# Altium project MotherBoard.PrjPcb (part 2 of 3)

## Sheet WIFI_BT.SchDoc
size A3; SheetNumber: 12; SheetTotal: 16
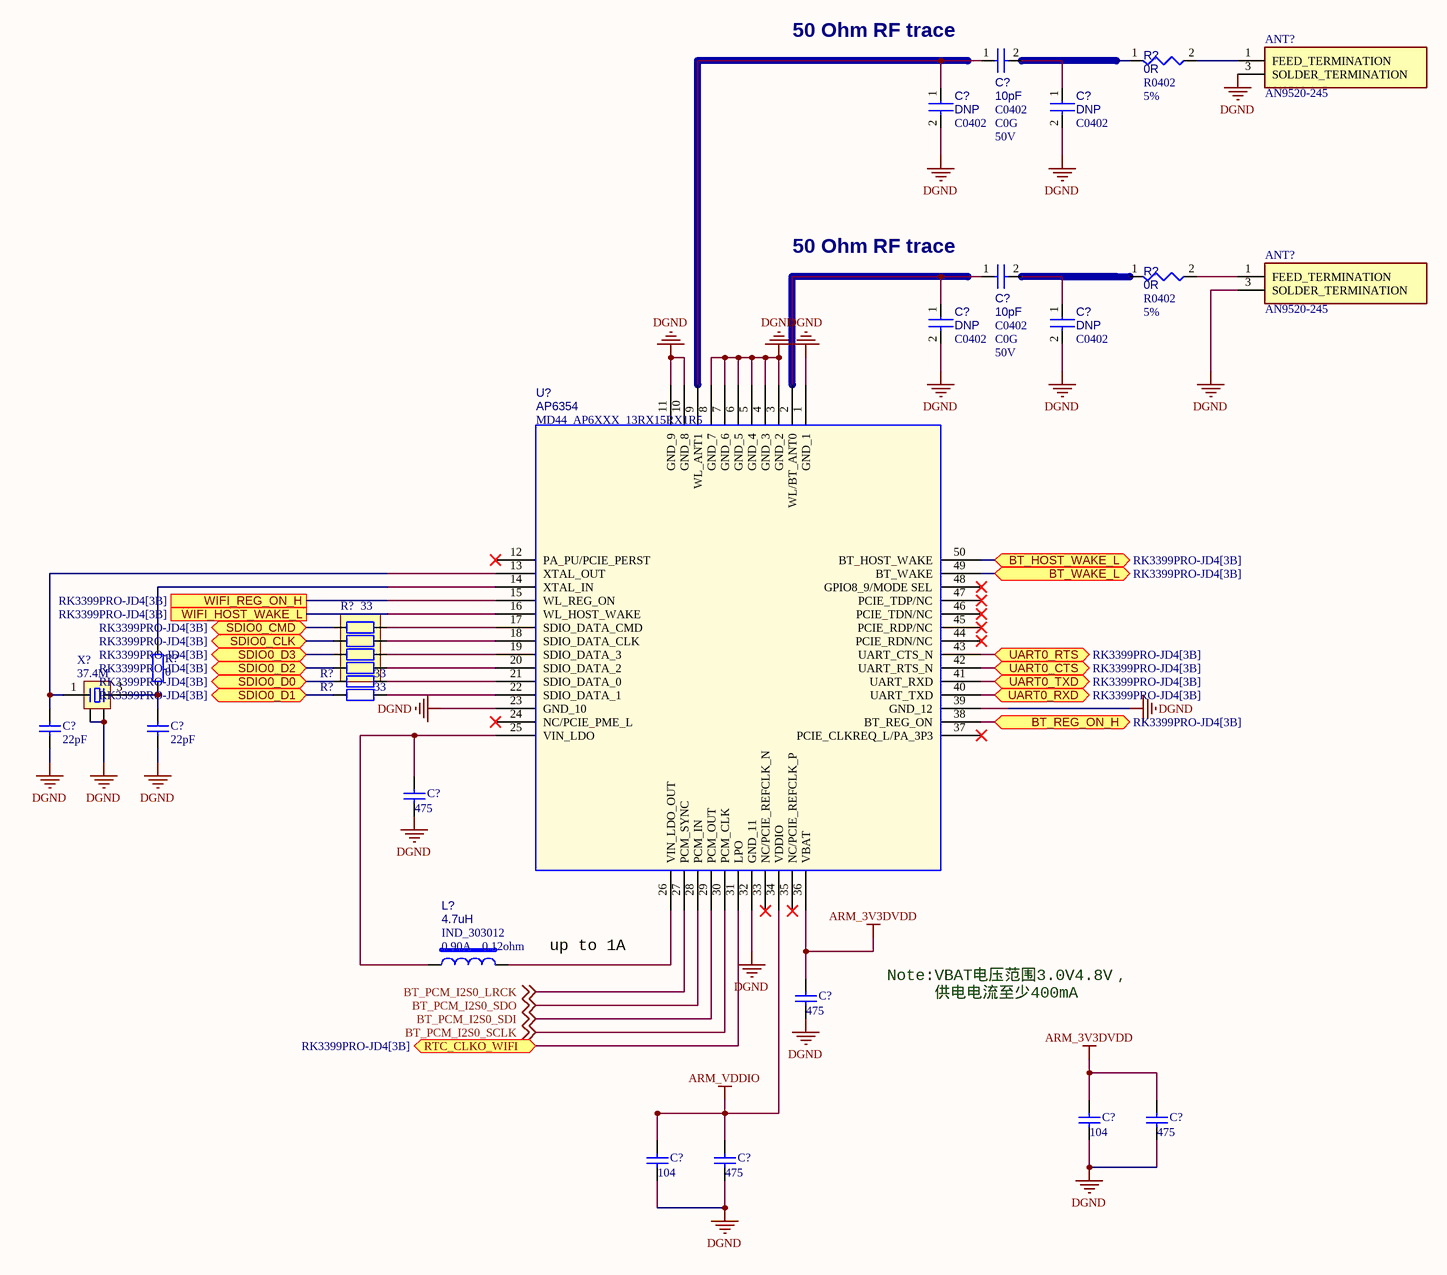
[diagram p7: WIFI_BT.SchDoc]

### Parts
(Parts that share a designator on the sheet are numbered #1, #2 ... from top to bottom, then left to right.)
ANT?#1  AN9520-245  [AN9520245]
ANT?#2  AN9520-245  [AN9520245]
C?#25  value 10pF  Voltage: 50V  Dielectric: C0G  [C0402]  (hidden comment: CAP NP_Dup3)
C?#26  value DNP  [C0402]  (hidden comment: CAP NP_Dup3)
C?#27  value DNP  [C0402]  (hidden comment: CAP NP_Dup3)
C?#28  value 10pF  Voltage: 50V  Dielectric: C0G  [C0402]  (hidden comment: CAP NP_Dup3)
C?#29  value DNP  [C0402]  (hidden comment: CAP NP_Dup3)
C?#30  value DNP  [C0402]  (hidden comment: CAP NP_Dup3)
C?#31  22pF  [C 0603_L]
C?#32  22pF  [C 0603_L]
C?#33  475  [C 0603_L]
C?#34  475  [C 0603_L]
C?#35  104  [C 0603_L]
C?#36  475  [C 0603_L]
C?#37  104  [C 0603_L]
C?#38  475  [C 0603_L]
L?#1  value 4.7uH  DC Resistor: 0.12ohm  Isat: 0.90A  PCB Footprint: IND_303012  [CD73]  (hidden comment: INDUCTORS OF FERRITE)
R?#46  value 0R  Tolerance: 5%  [R0402]  (hidden comment: RESISTOR_Dup2)
R?#47  value 0R  Tolerance: 5%  [R0402]  (hidden comment: RESISTOR_Dup2)
R?#48  33  [RCA-8P4R-0603]
R?#49  33  [R 0603_L]
R?#50  0  [R 0603_L]
R?#51  33  [R 0603_L]
U?#14  value AP6354  [MD44_AP6XXX_13RX15RX1R5]  (hidden comment: MODULE_AP6354)
X?#1  37.4M  [OSC 3225-4P]

### Ports
BT_HOST_WAKE_L (bidir, see RK3399PRO-JD4[3B]), BT_REG_ON_H (bidir, see RK3399PRO-JD4[3B]), BT_WAKE_L (bidir, see RK3399PRO-JD4[3B]), RTC_CLKO_WIFI (bidir, see RK3399PRO-JD4[3B]), SDIO0_CLK (bidir, see RK3399PRO-JD4[3B]), SDIO0_CMD (bidir, see RK3399PRO-JD4[3B]), SDIO0_D0 (bidir, see RK3399PRO-JD4[3B]), SDIO0_D1 (bidir, see RK3399PRO-JD4[3B]), SDIO0_D2 (bidir, see RK3399PRO-JD4[3B]), SDIO0_D3 (bidir, see RK3399PRO-JD4[3B]), UART0_CTS (bidir, see RK3399PRO-JD4[3B]), UART0_RTS (bidir, see RK3399PRO-JD4[3B]), UART0_RXD (bidir, see RK3399PRO-JD4[3B]), UART0_TXD (bidir, see RK3399PRO-JD4[3B]), WIFI_HOST_WAKE_L (see RK3399PRO-JD4[3B]), WIFI_REG_ON_H (see RK3399PRO-JD4[3B])

### Nets
ARM_3V3DVDD: C?#34.1 C?#35.1 C?#36.1 U?#14.36(VBAT)
ARM_VDDIO: C?#37.1 C?#38.1 U?#14.34(VDDIO)
DGND: ANT?#1.3(SOLDER_TERMINATION) ANT?#2.3(SOLDER_TERMINATION) C?#26.2 C?#27.2 C?#29.2 C?#30.2 C?#31.2 C?#32.2 C?#33.2 C?#34.2 C?#35.2 C?#36.2 C?#37.2 C?#38.2 U?#14.1(GND_1) U?#14.3(GND_2) U?#14.4(GND_3) U?#14.5(GND_4) U?#14.6(GND_5) U?#14.7(GND_6) U?#14.8(GND_7) U?#14.10(GND_8) U?#14.11(GND_9) U?#14.23(GND_10) U?#14.32(GND_11) U?#14.39(GND_12) X?#1.2 X?#1.4
BT_PCM_I2S0_LRCK: U?#14.27(PCM_SYNC) ; off-sheet BT_PCM_I2S0_LRCK
BT_PCM_I2S0_SCLK: U?#14.30(PCM_CLK) ; off-sheet BT_PCM_I2S0_SCLK
BT_PCM_I2S0_SDI: U?#14.29(PCM_OUT) ; off-sheet BT_PCM_I2S0_SDI
BT_PCM_I2S0_SDO: U?#14.28(PCM_IN) ; off-sheet BT_PCM_I2S0_SDO
GPIO0_B2_D_1.8V: U?#14.15(WL_REG_ON) ; port WIFI_REG_ON_H
PMUIO2_VOLSEL: U?#14.38(BT_REG_ON) ; port BT_REG_ON_H
RTC_CLKO_WIFI: U?#14.31(LPO) ; port RTC_CLKO_WIFI
SDIO0_CLKOUT: R?#48.2 ; port SDIO0_CLK
SDIO0_CMD: R?#48.1 ; port SDIO0_CMD
SDIO0_D0: R?#49.1 ; port SDIO0_D0
SDIO0_D1: R?#51.1 ; port SDIO0_D1
SDIO0_D2: R?#48.4 ; port SDIO0_D2
SDIO0_D3: R?#48.3 ; port SDIO0_D3
SDIO0_DETN: U?#14.49(BT_WAKE) ; port BT_WAKE_L
SDIO0_INTN: U?#14.50(BT_HOST_WAKE) ; port BT_HOST_WAKE_L
SDIO0_WRPT: U?#14.16(WL_HOST_WAKE) ; port WIFI_HOST_WAKE_L
UART0_CTSN: U?#14.42(UART_RTS_N) ; port UART0_CTS
UART0_RTSN: U?#14.43(UART_CTS_N) ; port UART0_RTS
UART0_RX: U?#14.40(UART_TXD) ; port UART0_RXD
UART0_TX: U?#14.41(UART_RXD) ; port UART0_TXD
NetANT?#1_1: ANT?#1.1(FEED_TERMINATION) R?#46.2
NetANT?#2_1: ANT?#2.1(FEED_TERMINATION) R?#47.2
NetC?#25_1: C?#25.1 C?#26.1 U?#14.9(WL_ANT1)
NetC?#25_2: C?#25.2 C?#27.1
NetC?#28_1: C?#28.1 C?#29.1 U?#14.2(WL/BT_ANT0)
NetC?#28_2: C?#28.2 C?#30.1
NetC?#31_1: C?#31.1 U?#14.13(XTAL_OUT) X?#1.1
NetC?#32_1: C?#32.1 R?#50.1 X?#1.3
NetC?#33_1: C?#33.1 L?#1.1 U?#14.25(VIN_LDO)
NetL?#1_2: L?#1.2 U?#14.26(VIN_LDO_OUT)
NetR?#48_5: R?#48.5 U?#14.20(SDIO_DATA_2)
NetR?#48_6: R?#48.6 U?#14.19(SDIO_DATA_3)
NetR?#48_7: R?#48.7 U?#14.18(SDIO_DATA_CLK)
NetR?#48_8: R?#48.8 U?#14.17(SDIO_DATA_CMD)
NetR?#49_2: R?#49.2 U?#14.21(SDIO_DATA_0)
NetR?#50_2: R?#50.2 U?#14.14(XTAL_IN)
NetR?#51_2: R?#51.2 U?#14.22(SDIO_DATA_1)

Not connected (* = marked no-connect by the designer): R?#46 1; R?#47 1; U?#14 12(PA_PU/PCIE_PERST)* 24(NC/PCIE_PME_L)* 33(NC/PCIE_REFCLK_N)* 35(NC/PCIE_REFCLK_P)* 37(PCIE_CLKREQ_L/PA_3P3)* 44(PCIE_RDN/NC)* 45(PCIE_RDP/NC)* 46(PCIE_TDN/NC)* 47(PCIE_TDP/NC)* 48(GPIO8_9/MODE_SEL)*

### Notes on the sheet
- (near C?#25) 50 Ohm RF trace
- (near C?#28) 50 Ohm RF trace
- up to 1A
- Note:VBAT电压范围3.0V4.8V，
  供电电流至少400mA

### Library data of the parts
ANT?#1 ANT?#2 = AN9520-245: Antenna; Manufacturer_Name: Rainsun microwave Tech; Datasheet Link: https://datasheet.lcsc.com/szlcsc/1810251713_Rainsun-microwave-Tech-AN9520-245_C99665.pdf; Height: 1.2mm; Manufacturer_Part_Number: AN9520-245
C?#25 = CAP NP_Dup3: cap,10.00pF,+/-0.5,50V,C0G,C0402; Part Reference: C6101; Manufacturer PN: C1005C0G1H100D050BA; Manufacturer: TDK; Tolerance: +/-0.5pF; Priority: A; PCB Footprint: C0402; Created by: JJJ; Part Type: C0402; RK PN: C1005C0G1H100D050BA
C?#26 = CAP NP_Dup3: Did Not Place.; Part Reference: C6102; Manufacturer PN: DNPC0402; Priority: A; PCB Footprint: C0402; Created by: JJJ; Part Type: DNP; RK PN: DNPC0402
C?#27 = CAP NP_Dup3: Did Not Place.; Part Reference: C6103; Manufacturer PN: DNPC0402; Priority: A; PCB Footprint: C0402; Created by: JJJ; Part Type: DNP; RK PN: DNPC0402
C?#28 = CAP NP_Dup3: cap,10.00pF,+/-0.5,50V,C0G,C0402; Part Reference: C6104; Manufacturer: TDK; RK PN: C1005C0G1H100D050BA; Priority: A; Tolerance: +/-0.5pF; PCB Footprint: C0402; Part Type: C0402; Manufacturer PN: C1005C0G1H100D050BA; Created by: JJJ
C?#29 = CAP NP_Dup3: Did Not Place.; Part Reference: C6105; RK PN: DNPC0402; Priority: A; PCB Footprint: C0402; Part Type: DNP; Manufacturer PN: DNPC0402; Created by: JJJ
C?#30 = CAP NP_Dup3: Did Not Place.; Part Reference: C6106; RK PN: DNPC0402; Priority: A; PCB Footprint: C0402; Part Type: DNP; Manufacturer PN: DNPC0402; Created by: JJJ
C?#31-C?#38 = Cap: Capacitor; Published: 8-Jun-2000; LatestRevisionDate: 17-Jul-2002; LatestRevisionNote: Re-released for DXP Platform.; PackageReference: RAD-0.3; Publisher: Altium Limited
  C?#31 C?#32: Value: 22pF
  C?#33 C?#34 C?#36 C?#38: Value: 475
  C?#35 C?#37: Value: 104
L?#1 = INDUCTORS OF FERRITE: Power Inductor,4.7uH,0.2,IND_303012; Part Reference: L6101; Manufacturer PN: SWPA3012S4R7MT; Manufacturer: sunlord; Resonace frequency: 61M; Irms: 1.24A; Tolerance: 20%; Priority: A; Created by: YTL; Part Type: POWER_IND; RK PN: SWPA3012S4R7MT
R?#46 = RESISTOR_Dup2: 通用厚膜电阻,0R,+/-5%,R0402,1/16W.; Part Reference: R6102; Manufacturer: YAGEO; RK PN: RC0402JR-070RL; Priority: A; Wattage: 1/16W; PCB Footprint: R0402; Part Type: 通用厚膜电阻; Manufacturer PN: RC0402JR-070RL; Created by: YTL
R?#47 = RESISTOR_Dup2: 通用厚膜电阻,0R,+/-5%,R0402,1/16W.; Part Reference: R6104; Manufacturer: YAGEO; RK PN: RC0402JR-070RL; Priority: A; Wattage: 1/16W; PCB Footprint: R0402; Part Type: 通用厚膜电阻; Manufacturer PN: RC0402JR-070RL; Created by: YTL
R?#48 = R-8P4R: 贴片排阻; BOM名称: 贴片网络排阻
R?#49 R?#51 = 0805 电阻: 贴片电阻 0805 电阻; ComponentLink1Description: 供应商链接; ComponentLink1URL: http://www.szlcsc.com/product/details_18165.html; Package: 0805; Supplier: LC; SuppliersPartNumber: C17477
R?#50 = R: as R?#23 on sheet DigiConn; BOM名称: 贴片电阻; 联系售后: https://shop463601444.taobao.com
U?#14 = MODULE_AP6354: 2x2 WiFi + Bluetooth4.1; Part Reference: U6101; Manufacturer: Ampak（正基科技）; Priority: A; PCB Footprint: MD44_AP6XXX_13RX15RX1R5; Created by: JJJ; Manufacturer PN: AP6354; Part Type: module; RK PN: AP6354
X?#1 = XTAL-4P: 4脚无源晶振; 版权归属: 封装库来自淘宝卖家 ID：黄晶宝石; BOM名称: 4脚无源晶振; 学习资源: https://shop463601444.taobao.com

## Sheet CODEC.SchDoc
size A3; SheetNumber: 14; SheetTotal: 16
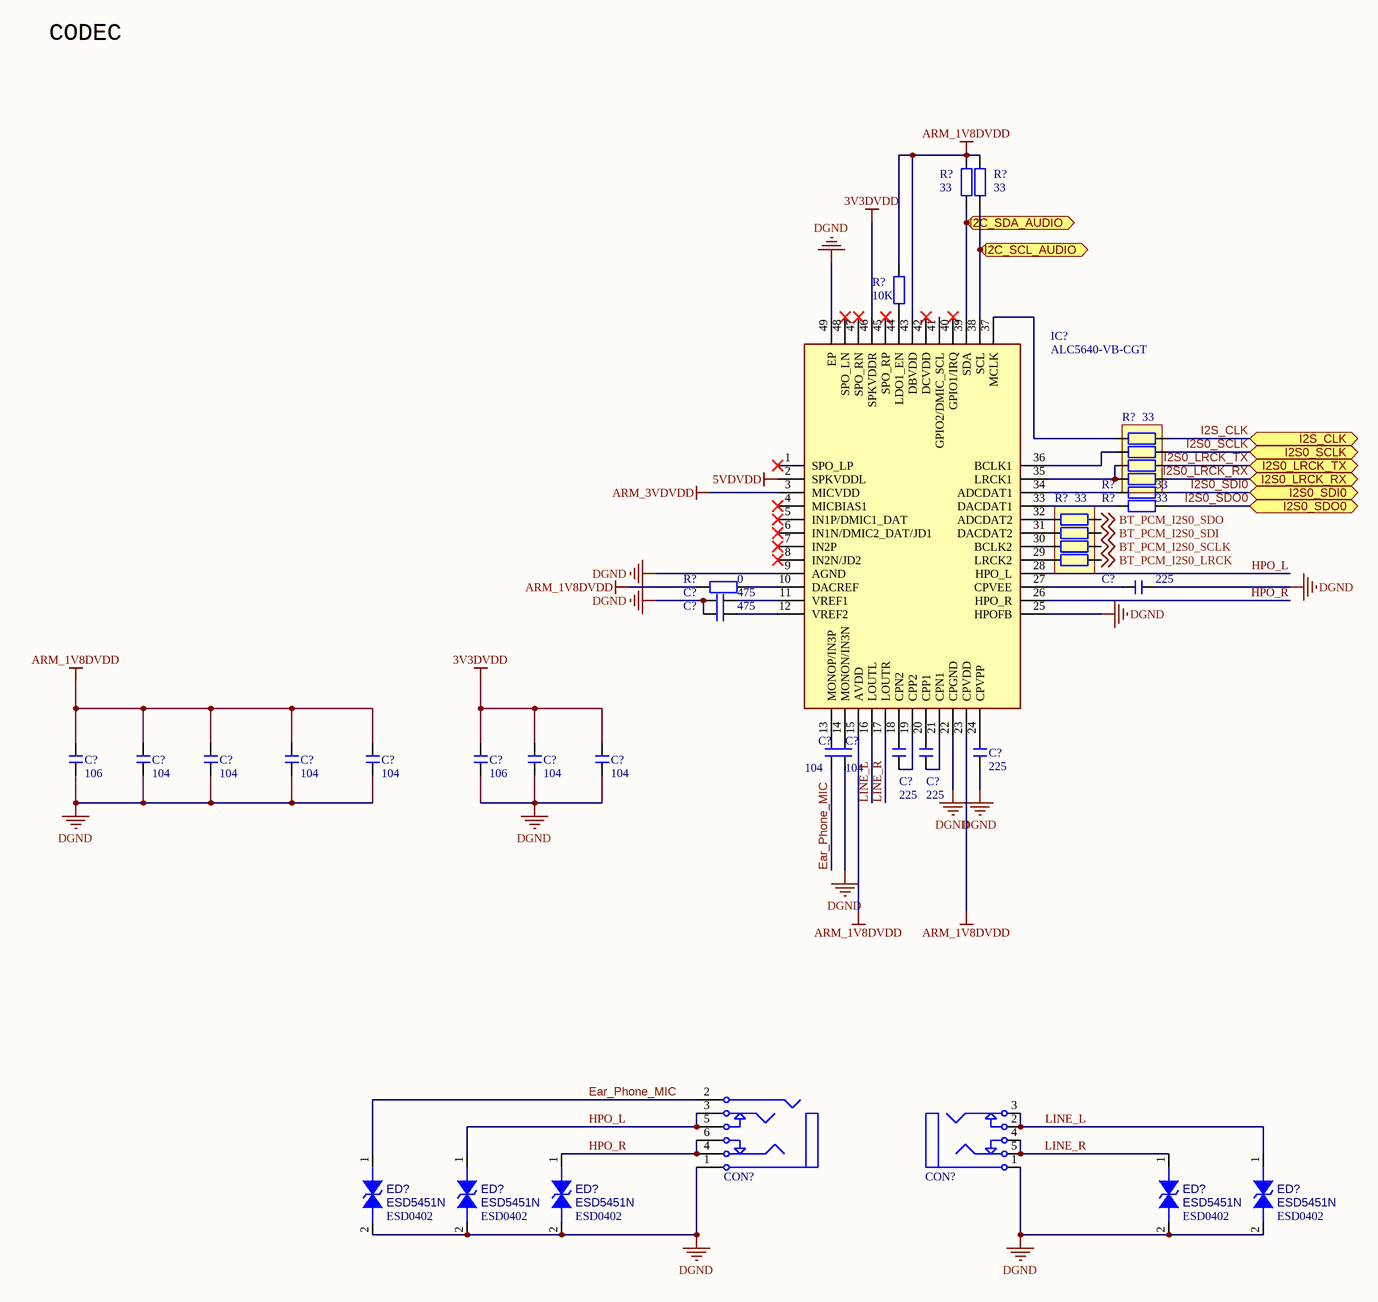
[diagram p8: CODEC.SchDoc]

### Parts
(Parts that share a designator on the sheet are numbered #1, #2 ... from top to bottom, then left to right.)
C?#39  225  [C 0603_L]
C?#40  475  [C 0603_L]
C?#41  475  [C 0603_L]
C?#42  104  [C 0603_L]
C?#43  104  [C 0603_L]
C?#44  225  [C 0603_L]
C?#45  225  [C 0603_L]
C?#46  225  [C 0603_L]
C?#47  106  [C 0603_L]
C?#48  104  [C 0603_L]
C?#49  104  [C 0603_L]
C?#50  104  [C 0603_L]
C?#51  104  [C 0603_L]
C?#52  106  [C 0603_L]
C?#53  104  [C 0603_L]
C?#54  104  [C 0603_L]
CON?#1  PJ325_BK  [PJ325_PK]  (value not drawn)
CON?#2  PJ342  [PJ342B]  (value not drawn)
ED?#1  value ESD5451N  [ESD0402]  (hidden comment: DIODE BI_DIR TRIG)
ED?#2  value ESD5451N  [ESD0402]  (hidden comment: DIODE BI_DIR TRIG)
ED?#3  value ESD5451N  [ESD0402]  (hidden comment: DIODE BI_DIR TRIG)
ED?#4  value ESD5451N  PCB Footprint: ESD0402  [SOD-323]  (hidden comment: DIODE BI_DIR TRIG)
ED?#5  value ESD5451N  PCB Footprint: ESD0402  [SOD-323]  (hidden comment: DIODE BI_DIR TRIG)
IC?#5  ALC5640-VB-CGT  [QFN40P600X600X100-49N]
R?#52  33  [R 0603_L]
R?#53  33  [R 0603_L]
R?#54  10K  [R 0603_L]
R?#55  33  [RCA-8P4R-0603]
R?#56  33  [R 0603_L]
R?#57  33  [R 0603_L]
R?#58  33  [RCA-8P4R-0603]
R?#59  0  [R 0603_L]

### Ports
I2C_SCL_AUDIO (bidir), I2C_SDA_AUDIO (bidir), I2S0_LRCK_RX (bidir), I2S0_LRCK_TX (bidir), I2S0_SCLK (bidir), I2S0_SDI0 (bidir), I2S0_SDO0 (bidir), I2S_CLK (bidir)

### Nets
3V3DVDD: C?#52.2 C?#53.2 C?#54.2 IC?#5.46(SPKVDDR)
5VDVDD: IC?#5.2(SPKVDDL)
ARM_1V8DVDD: C?#47.2 C?#48.2 C?#49.2 C?#50.2 C?#51.2 IC?#5.15(AVDD) IC?#5.23(CPVDD) IC?#5.43(DBVDD) R?#52.2 R?#53.2 R?#54.2 R?#59.1
ARM_3VDVDD: IC?#5.3(MICVDD)
DGND: C?#39.1 C?#40.2 C?#41.2 C?#43.2 C?#46.2 C?#47.1 C?#48.1 C?#49.1 C?#50.1 C?#51.1 C?#52.1 C?#53.1 C?#54.1 CON?#1.1 CON?#2.1 ED?#1.2 ED?#2.2 ED?#3.2 ED?#4.2 ED?#5.2 IC?#5.9(AGND) IC?#5.22(CPGND) IC?#5.25(HPOFB) IC?#5.49(EP)
BT_PCM_I2S0_LRCK: R?#58.5 ; off-sheet BT_PCM_I2S0_LRCK
BT_PCM_I2S0_SCLK: R?#58.6 ; off-sheet BT_PCM_I2S0_SCLK
BT_PCM_I2S0_SDI: R?#58.7 ; off-sheet BT_PCM_I2S0_SDI
BT_PCM_I2S0_SDO: R?#58.8 ; off-sheet BT_PCM_I2S0_SDO
Ear_Phone_MIC: C?#42.2 CON?#2.2 ED?#1.1
HPO_L: CON?#2.3 CON?#2.5 ED?#2.1 IC?#5.28(HPO_L)
HPO_R: CON?#2.4 CON?#2.6 ED?#3.1 IC?#5.26(HPO_R)
I2C1_SCL: IC?#5.38(SCL) R?#53.1 ; port I2C_SCL_AUDIO
I2C1_SDA: IC?#5.39(SDA) R?#52.1 ; port I2C_SDA_AUDIO
I2S0_LRCK_RX: R?#55.5 ; port I2S0_LRCK_RX
I2S0_LRCK_TX: R?#55.6 ; port I2S0_LRCK_TX
I2S0_SCLK: R?#55.7 ; port I2S0_SCLK
I2S0_SDI0: R?#56.2 ; port I2S0_SDI0
I2S0_SDO0: R?#57.2 ; port I2S0_SDO0
I2S_CLK: R?#55.8 ; port I2S_CLK
LINE_L: CON?#1.2 CON?#1.3 ED?#5.1 IC?#5.16(LOUTL)
LINE_R: CON?#1.4 CON?#1.5 ED?#4.1 IC?#5.17(LOUTR)
NetC?#39_2: C?#39.2 IC?#5.27(CPVEE)
NetC?#40_1: C?#40.1 IC?#5.11(VREF1)
NetC?#41_1: C?#41.1 IC?#5.12(VREF2)
NetC?#42_1: C?#42.1 IC?#5.13(MONOP/IN3P)
NetC?#43_1: C?#43.1 IC?#5.14(MONON/IN3N)
NetC?#44_1: C?#44.1 IC?#5.18(CPN2)
NetC?#44_2: C?#44.2 IC?#5.19(CPP2)
NetC?#45_1: C?#45.1 IC?#5.20(CPP1)
NetC?#45_2: C?#45.2 IC?#5.21(CPN1)
NetC?#46_1: C?#46.1 IC?#5.24(CPVPP)
NetIC?#5_10: IC?#5.10(DACREF) R?#59.2
NetIC?#5_29: IC?#5.29(LRCK2) R?#58.4
NetIC?#5_30: IC?#5.30(BCLK2) R?#58.3
NetIC?#5_31: IC?#5.31(DACDAT2) R?#58.2
NetIC?#5_32: IC?#5.32(ADCDAT2) R?#58.1
NetIC?#5_33: IC?#5.33(DACDAT1) R?#57.1
NetIC?#5_34: IC?#5.34(ADCDAT1) R?#56.1
NetIC?#5_35: IC?#5.35(LRCK1) R?#55.3 R?#55.4
NetIC?#5_36: IC?#5.36(BCLK1) R?#55.2
NetIC?#5_37: IC?#5.37(MCLK) R?#55.1
NetIC?#5_44: IC?#5.44(LDO1_EN) R?#54.1

Not connected (* = marked no-connect by the designer): IC?#5 1(SPO_LP)* 4(MICBIAS1)* 5(IN1P/DMIC1_DAT)* 6(IN1N/DMIC2_DAT/JD1)* 7(IN2P)* 8(IN2N/JD2)* 40(GPIO1/IRQ)* 41(GPIO2/DMIC_SCL) 42(DCVDD)* 45(SPO_RP)* 47(SPO_RN)* 48(SPO_LN)*

### Notes on the sheet
- CODEC

### Library data of the parts
C?#39-C?#54 = C: 贴片电容
CON?#1 = PJ325: 3.5mm耳机插座; BOM名称: 耳机插座; 版权归属: 封装库来自淘宝 ID：黄晶宝石; 学习资源: https://shop463601444.taobao.com
CON?#2 = PJ342: 3.5耳机插座,4Pin; BOM名称: 耳机插座; 版权归属: 封装库来自淘宝 ID：黄晶宝石; 学习资源: https://shop463601444.taobao.com
ED?#1 = DIODE BI_DIR TRIG: 1-Line, Bi-directional, Transient Voltage Suppressors.17.5pF.; Part Reference: ED7101; Manufacturer: WillSemi(韦尔半导体); Priority: A; PCB Footprint: ESD0402; RK PN: ESD5451N; Part Type: ESD_TVS; Manufacturer PN: ESD5451N; Created by: JJJ
ED?#2 = DIODE BI_DIR TRIG: 1-Line, Bi-directional, Transient Voltage Suppressors.17.5pF.; Part Reference: ED7103; Manufacturer: WillSemi(韦尔半导体); Priority: A; PCB Footprint: ESD0402; Created by: JJJ; Manufacturer PN: ESD5451N; Part Type: ESD_TVS; RK PN: ESD5451N
ED?#3 = DIODE BI_DIR TRIG: 1-Line, Bi-directional, Transient Voltage Suppressors.17.5pF.; Part Reference: ED7102; Manufacturer: WillSemi(韦尔半导体); Priority: A; PCB Footprint: ESD0402; Created by: JJJ; Manufacturer PN: ESD5451N; Part Type: ESD_TVS; RK PN: ESD5451N
ED?#4 ED?#5 = DIODE BI_DIR TRIG: 1-Line, Bi-directional, Transient Voltage Suppressors.17.5pF.; Part Reference: ED7104; Manufacturer: WillSemi(韦尔半导体); Priority: A; Created by: JJJ; Manufacturer PN: ESD5451N; Part Type: ESD_TVS; RK PN: ESD5451N
IC?#5 = ALC5640-VB-CGT: Integrated Circuit; Manufacturer_Name: Realtek; Datasheet Link: https://www.alldatasheet.com/view.jsp?Searchword=ALC5640-VB-CGT; Height: 1mm; Manufacturer_Part_Number: ALC5640-VB-CGT
R?#52-R?#54 R?#56 R?#57 R?#59 = 0805 电阻: 贴片电阻 0805 电阻; ComponentLink1Description: 供应商链接; ComponentLink1URL: http://www.szlcsc.com/product/details_18165.html; Package: 0805; Supplier: LC; SuppliersPartNumber: C17477
R?#55 R?#58 = R-8P4R: 贴片排阻; BOM名称: 贴片网络排阻

## Sheet HDMI.SchDoc
size A4; SheetNumber: 11; SheetTotal: 11
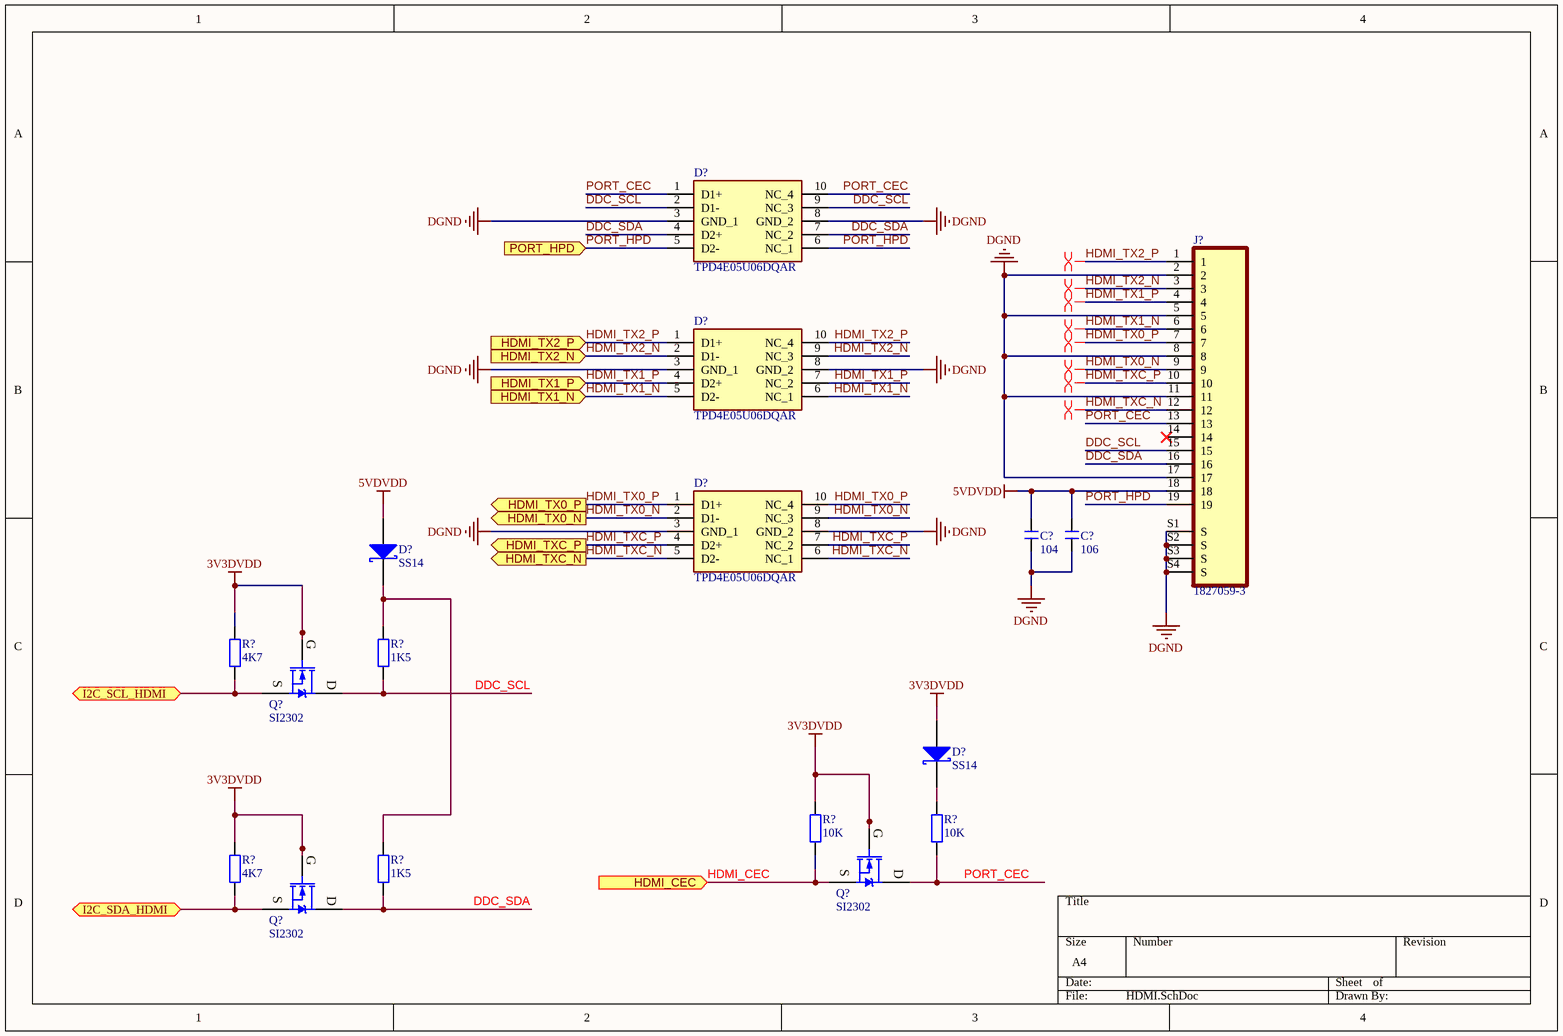
[diagram p9: HDMI.SchDoc]

### Parts
(Parts that share a designator on the sheet are numbered #1, #2 ... from top to bottom, then left to right.)
C?#55  104  [C 0603_L]
C?#56  106  [C 0603_L]
D?#26  TPD4E05U06DQAR  [DQA(R-PUSON-N10)]
D?#27  TPD4E05U06DQAR  [DQA(R-PUSON-N10)]
D?#28  TPD4E05U06DQAR  [DQA(R-PUSON-N10)]
D?#29  SS14  [SMA]
D?#30  SS14  [SMA]
J?#9  1827059-3  [TE_1827059-3]
Q?#15  SI2302  [SOT23-3N]
Q?#16  SI2302  [SOT23-3N]
Q?#17  SI2302  [SOT23-3N]
R?#60  4K7  [R 0603_L]
R?#61  1K5  [R 0603_L]
R?#62  10K  [R 0603_L]
R?#63  10K  [R 0603_L]
R?#64  4K7  [R 0603_L]
R?#65  1K5  [R 0603_L]

### Ports
HDMI_CEC (in), HDMI_TX0_N (out), HDMI_TX0_P (out), HDMI_TX1_N (in), HDMI_TX1_P (in), HDMI_TX2_N (in), HDMI_TX2_P (in), HDMI_TXC_N (out), HDMI_TXC_P (out), I2C_SCL_HDMI (bidir), I2C_SDA_HDMI (bidir), PORT_HPD (in)

### Nets
3V3DVDD: D?#30.1(A) Q?#15.1(G) Q?#16.1(G) Q?#17.1(G) R?#60.2 R?#62.2 R?#64.2
5VDVDD: C?#55.2 C?#56.2 D?#29.1(A) J?#9.18
DGND: C?#55.1 C?#56.1 D?#26.3(GND_1) D?#26.8(GND_2) D?#27.3(GND_1) D?#27.8(GND_2) D?#28.3(GND_1) D?#28.8(GND_2) J?#9.2 J?#9.5 J?#9.8 J?#9.11 J?#9.17 J?#9.S1(S) J?#9.S2(S) J?#9.S3(S) J?#9.S4(S)
DDC_SCL: D?#26.2(D1-) D?#26.9(NC_3) J?#9.15 Q?#15.3(D) R?#61.1
DDC_SDA: D?#26.4(D2+) D?#26.7(NC_2) J?#9.16 Q?#17.3(D) R?#65.1
HDMI_CEC: Q?#16.2(S) R?#62.1 ; port HDMI_CEC
HDMI_I2C3_SCL: Q?#15.2(S) R?#60.1 ; port I2C_SCL_HDMI
HDMI_I2C3_SDA: Q?#17.2(S) R?#64.1 ; port I2C_SDA_HDMI
HDMI_TX0_N: D?#28.2(D1-) D?#28.9(NC_3) J?#9.9 ; port HDMI_TX0_N
HDMI_TX0_P: D?#28.1(D1+) D?#28.10(NC_4) J?#9.7 ; port HDMI_TX0_P
HDMI_TX1_N: D?#27.5(D2-) D?#27.6(NC_1) J?#9.6 ; port HDMI_TX1_N
HDMI_TX1_P: D?#27.4(D2+) D?#27.7(NC_2) J?#9.4 ; port HDMI_TX1_P
HDMI_TX2_N: D?#27.2(D1-) D?#27.9(NC_3) J?#9.3 ; port HDMI_TX2_N
HDMI_TX2_P: D?#27.1(D1+) D?#27.10(NC_4) J?#9.1 ; port HDMI_TX2_P
HDMI_TXC_N: D?#28.5(D2-) D?#28.6(NC_1) J?#9.12 ; port HDMI_TXC_N  [project net HDMI_TCN]
HDMI_TXC_P: D?#28.4(D2+) D?#28.7(NC_2) J?#9.10 ; port HDMI_TXC_P  [project net HDMI_TCP]
PORT_CEC: D?#26.1(D1+) D?#26.10(NC_4) J?#9.13 Q?#16.3(D) R?#63.1
PORT_HPD: D?#26.5(D2-) D?#26.6(NC_1) J?#9.19 ; port PORT_HPD  [project net HDMI_HPD]
NetD?#29_2: D?#29.2(K) R?#61.2 R?#65.2
NetD?#30_2: D?#30.2(K) R?#63.2

Not connected (* = marked no-connect by the designer): J?#9 14*

### Layout directives
differential pair: HDMI_TCN, HDMI_TCP, HDMI_TX0_N, HDMI_TX0_P, HDMI_TX1_N, HDMI_TX1_P, HDMI_TX2_N, HDMI_TX2_P

### Library data of the parts
C?#55 C?#56 = C: 贴片电容; BOM名称: 无极性贴片电容; 淘宝ID: 封装库来自淘宝 ID：黄晶宝石; 联系售后，技术支持: https://shop463601444.taobao.com; 唯一出售店铺网址: https://shop463601444.taobao.com
D?#26-D?#28 = TPD4E05U06DQAR: Diode; Manufacturer_Name: Texas Instruments; Datasheet Link: http://www.ti.com/lit/gpn/tpd4e05u06; Manufacturer_Part_Number: TPD4E05U06DQAR; Mouser Part Number: 595-TPD4E05U06DQAR; Mouser Price/Stock: https://www.mouser.co.uk/ProductDetail/Texas-Instruments/TPD4E05U06DQAR?qs=%2FCrDlo5IrVPi4woOvWz0qA%3D%3D; Arrow Part Number: TPD4E05U06DQAR; Arrow Price/Stock: https://www.arrow.com/en/products/tpd4e05u06dqar/texas-instruments?region=nac
D?#29 D?#30 = SS14: 肖特基二极管; 属性: 40V/1A; BOM名称: 肖特基二极管; 封装库来自淘宝 ID：黄晶宝石: https://shop463601444.taobao.com
J?#9 = 1827059-3: EMBOSS PACKAGE HDMI CONN SMT NO-FLANGE T; MF: TE Connectivity; Price: None; Availability: In Stock; MP: 1827059-3; Package: None; SnapEDA_Link: https://www.snapeda.com/parts/1827059-3/TE+Connectivity+AMP+Connectors/view-part/?ref=snap; Check_prices: https://www.snapeda.com/parts/1827059-3/TE+Connectivity+AMP+Connectors/view-part/?ref=eda; Value: *; EU_RoHS_Compliance: Compliant; Purchase-URL: https://pricing.snapeda.com/search/part/1827059-3/?ref=eda
Q?#15-Q?#17 = SI2302: N沟道场效应管; 技术支持，联系售后: 封装库来自淘宝 ID：黄晶宝石; BOM名称: N沟道场效应管; 学习资源: https://shop463601444.taobao.com
R?#60-R?#65 = R: 贴片电阻; 版权归属: 来自淘宝 ID：黄晶宝石; 封装库来自淘宝卖家 ID：黄晶宝石: 其他店铺购入均为盗版，不享受售后技术支持服务，请立即申请退款; BOM名称: 贴片电阻; 联系售后: https://shop463601444.taobao.com

## Sheet EthernetRTL8211.SchDoc
size A4; SheetNumber: 8; SheetTotal: 16
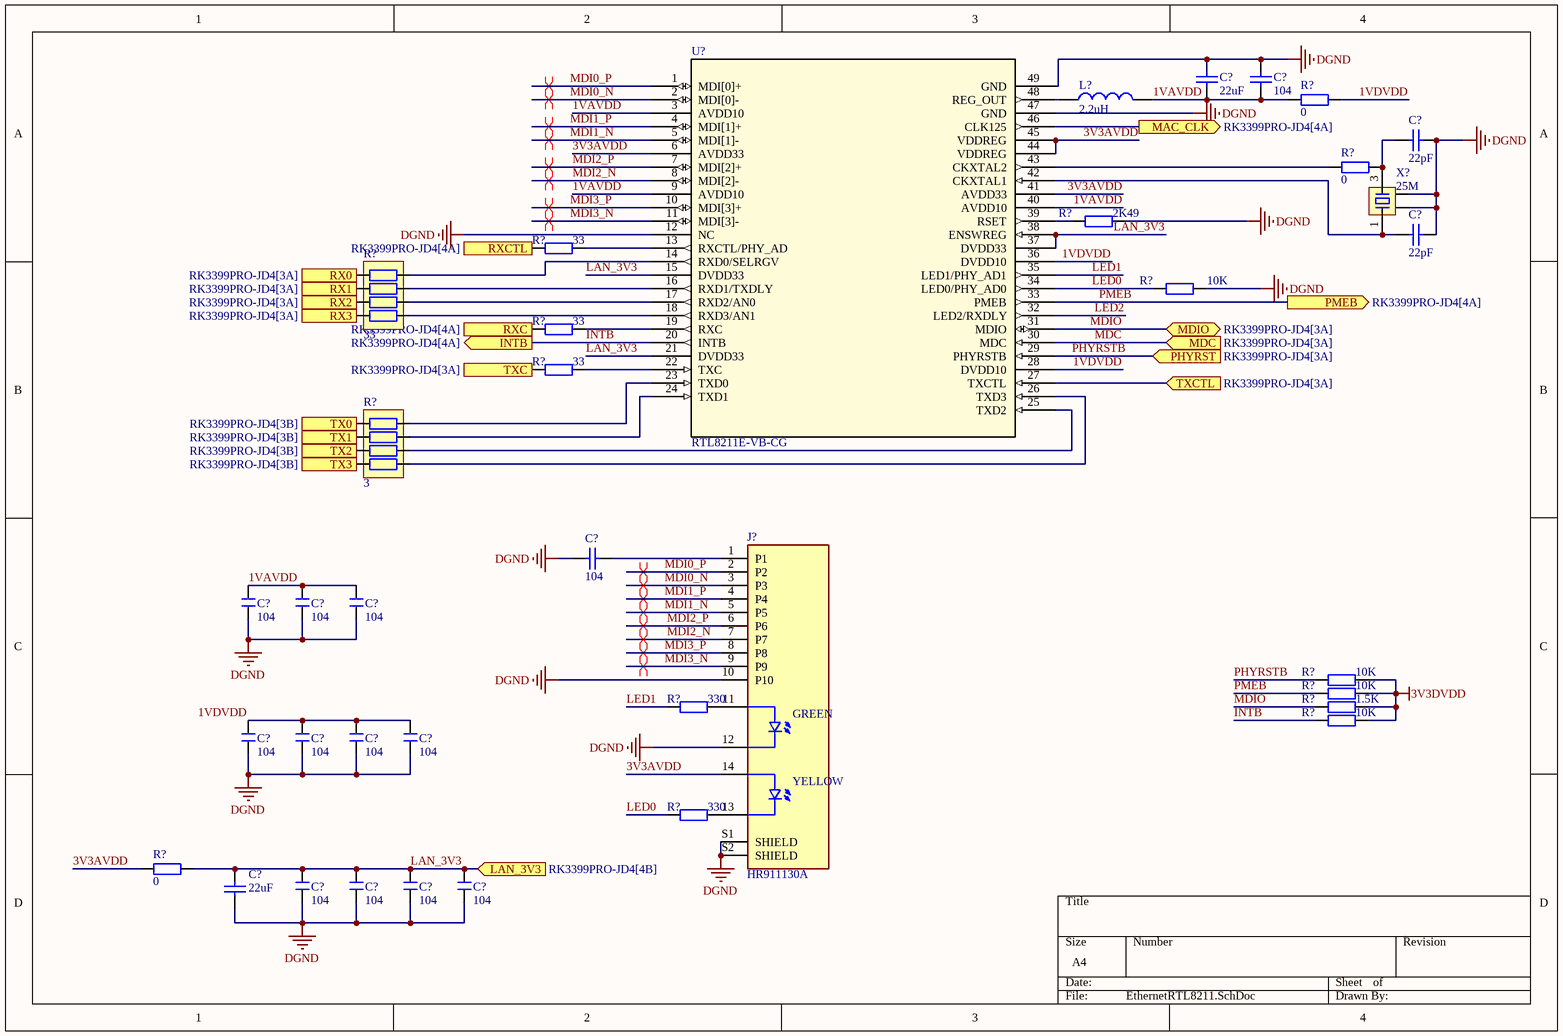
[diagram p10: EthernetRTL8211.SchDoc]

### Parts
(Parts that share a designator on the sheet are numbered #1, #2 ... from top to bottom, then left to right.)
C?#57  22uF  [0603_C]
C?#58  104  [0603_C]
C?#59  22pF  [0603_C]
C?#60  22pF  [0603_C]
C?#61  104  [0603_C]
C?#62  104  [C 0603_L]
C?#63  104  [C 0603_L]
C?#64  104  [C 0603_L]
C?#65  104  [C 0603_L]
C?#66  104  [C 0603_L]
C?#67  104  [C 0603_L]
C?#68  104  [C 0603_L]
C?#69  22uF  [0603_C]
C?#70  104  [C 0603_L]
C?#71  104  [C 0603_L]
C?#72  104  [C 0603_L]
C?#73  104  [C 0603_L]
J?#10  HR911130A  [HANRUN_HR911130A]
L?#2  2.2uH  [CD75]
R?#66  0  [R 0603_L]
R?#67  0  [R 0603_L]
R?#68  2K49  [R 0603_L]
R?#69  33  [R 0603_L]
R?#70  33  [RCA-8P4R-0603]
R?#71  10K  [R 0603_L]
R?#72  33  [R 0603_L]
R?#73  33  [R 0603_L]
R?#74  3  [RCA-8P4R-0603]
R?#75  10K  [R 0603_L]
R?#76  10K  [R 0603_L]
R?#77  330  [R 0603_L]
R?#78  1.5K  [R 0603_L]
R?#79  10K  [R 0603_L]
R?#80  330  [R 0603_L]
R?#81  0  [R 0603_L]
U?#15  RTL8211E-VB-CG  [QFN48 7X7_L]
X?#2  25M  [OSC 3225-4P]

### Ports
INTB (out, see RK3399PRO-JD4[4A]), LAN_3V3 (in, see RK3399PRO-JD4[4B]), MAC_CLK (out, see RK3399PRO-JD4[4A]), MDC (in, see RK3399PRO-JD4[3A]), MDIO (bidir, see RK3399PRO-JD4[3A]), PHYRST (in, see RK3399PRO-JD4[3A]), PMEB (out, see RK3399PRO-JD4[4A]), RX0 (in, see RK3399PRO-JD4[3A]), RX1 (in, see RK3399PRO-JD4[3A]), RX2 (in, see RK3399PRO-JD4[3A]), RX3 (in, see RK3399PRO-JD4[3A]), RXC (out, see RK3399PRO-JD4[4A]), RXCTL (out, see RK3399PRO-JD4[4A]), TX0 (in, see RK3399PRO-JD4[3B]), TX1 (in, see RK3399PRO-JD4[3B]), TX2 (in, see RK3399PRO-JD4[3B]), TX3 (in, see RK3399PRO-JD4[3B]), TXC (in, see RK3399PRO-JD4[3A]), TXCTL (in, see RK3399PRO-JD4[3A])

### Nets
3V3DVDD: R?#75.1 R?#76.1 R?#78.1 R?#79.1
DGND: C?#57.1 C?#58.1 C?#59.2 C?#60.2 C?#61.1 C?#62.1 C?#63.1 C?#64.1 C?#65.1 C?#66.1 C?#67.1 C?#68.1 C?#69.1 C?#70.1 C?#71.1 C?#72.1 C?#73.1 J?#10.10(P10) J?#10.12 J?#10.S1(SHIELD) J?#10.S2(SHIELD) R?#68.1 R?#71.1 U?#15.12(NC) U?#15.47(GND) U?#15.49(GND) X?#2.2 X?#2.4
LAN_3V3: C?#69.2 C?#70.2 C?#71.2 C?#72.2 C?#73.2 R?#81.1 U?#15.15(DVDD33) U?#15.21(DVDD33) U?#15.37(DVDD33) U?#15.38(ENSWREG) ; port LAN_3V3
1VAVDD: C?#57.2 C?#58.2 C?#62.2 C?#63.2 C?#64.2 L?#2.2 R?#66.2 U?#15.3(AVDD10) U?#15.9(AVDD10) U?#15.40(AVDD10)
1VDVDD: C?#65.2 C?#66.2 C?#67.2 C?#68.2 R?#66.1 U?#15.28(DVDD10) U?#15.36(DVDD10)
3V3AVDD: J?#10.14 R?#81.2 U?#15.6(AVDD33) U?#15.41(AVDD33) U?#15.44(VDDREG) U?#15.45(VDDREG)
INTB: R?#79.2 U?#15.20(INTB) ; port INTB
LED0: R?#71.2 R?#80.2 U?#15.34(LED0/PHY_AD0)
LED1: R?#77.2 U?#15.35(LED1/PHY_AD1)
LED2: U?#15.32(LED2/RXDLY)
MAC_CLK: U?#15.46(CLK125) ; port MAC_CLK
MAC_RXCLK: R?#72.2 ; port RXC
MAC_RXD0: R?#70.1 ; port RX0
MAC_RXD1: R?#70.2 ; port RX1
MAC_RXD2: R?#70.3 ; port RX2
MAC_RXD3: R?#70.4 ; port RX3
MAC_RXDV: R?#69.2 ; port RXCTL
MAC_TXCLK: R?#73.2 ; port TXC
MAC_TXD0: R?#74.1 ; port TX0
MAC_TXD1: R?#74.2 ; port TX1
MAC_TXD2: R?#74.3 ; port TX2
MAC_TXD3: R?#74.4 ; port TX3
MAC_TXEN: U?#15.27(TXCTL) ; port TXCTL
MDC: U?#15.30(MDC) ; port MDC  [project net MAC_MDC]
MDI0_N: J?#10.3(P3) U?#15.2(MDI[0]-)
MDI0_P: J?#10.2(P2) U?#15.1(MDI[0]+)
MDI1_N: J?#10.5(P5) U?#15.5(MDI[1]-)
MDI1_P: J?#10.4(P4) U?#15.4(MDI[1]+)
MDI2_N: J?#10.7(P7) U?#15.8(MDI[2]-)
MDI2_P: J?#10.6(P6) U?#15.7(MDI[2]+)
MDI3_N: J?#10.9(P9) U?#15.11(MDI[3]-)
MDI3_P: J?#10.8(P8) U?#15.10(MDI[3]+)
MDIO: R?#78.2 U?#15.31(MDIO) ; port MDIO  [project net MAC_MDIO]
PHYRSTB: R?#75.2 U?#15.29(PHYRSTB) ; port PHYRST  [project net PHY_RST]
PMEB: R?#76.2 U?#15.33(PMEB) ; port PMEB
NetC?#59_1: C?#59.1 R?#67.1 X?#2.3
NetC?#60_1: C?#60.1 U?#15.42(CKXTAL1) X?#2.1
NetC?#61_2: C?#61.2 J?#10.1(P1)
NetJ?#10_11: J?#10.11 R?#77.1
NetJ?#10_13: J?#10.13 R?#80.1
NetL?#2_1: L?#2.1 U?#15.48(REG_OUT)
NetR?#67_2: R?#67.2 U?#15.43(CKXTAL2)
NetR?#68_2: R?#68.2 U?#15.39(RSET)
NetR?#69_1: R?#69.1 U?#15.13(RXCTL/PHY_AD)
NetR?#70_5: R?#70.5 U?#15.18(RXD3/AN1)
NetR?#70_6: R?#70.6 U?#15.17(RXD2/AN0)
NetR?#70_7: R?#70.7 U?#15.16(RXD1/TXDLY)
NetR?#70_8: R?#70.8 U?#15.14(RXD0/SELRGV)
NetR?#72_1: R?#72.1 U?#15.19(RXC)
NetR?#73_1: R?#73.1 U?#15.22(TXC)
NetR?#74_5: R?#74.5 U?#15.26(TXD3)
NetR?#74_6: R?#74.6 U?#15.25(TXD2)
NetR?#74_7: R?#74.7 U?#15.24(TXD1)
NetR?#74_8: R?#74.8 U?#15.23(TXD0)

### Layout directives
differential pair: MDI0_N, MDI0_P, MDI1_N, MDI1_P, MDI2_N, MDI2_P, MDI3_N, MDI3_P

### Notes on the sheet
- (in symbol HR911130A) GREEN; YELLOW

### Library data of the parts
C?#57-C?#61 C?#69 = Cap: Capacitor; Published: 8-Jun-2000; LatestRevisionDate: 17-Jul-2002; LatestRevisionNote: Re-released for DXP Platform.; PackageReference: RAD-0.3; Publisher: Altium Limited
  C?#57 C?#69: Value: 22uF
  C?#58 C?#61: Value: 104
  C?#59 C?#60: Value: 22pF
C?#62-C?#68 C?#70-C?#73 = C: as C?#55 on sheet HDMI; 联系售后，技术支持: https://shop463601444.taobao.com; 唯一出售店铺网址: https://shop463601444.taobao.com
J?#10 = HR911130A: MF: hanrun; SnapEDA_Link: https://www.snapeda.com/parts/HR911130A/HanRun/view-part/?ref=snap; MP: HR911130A; Price: None; Package: None; Check_prices: https://www.snapeda.com/parts/HR911130A/HanRun/view-part/?ref=eda; Value: *; Availability: Not in stock
L?#2 = L: 小功率贴片电感; 淘宝ID: 封装库来自淘宝 ID：黄晶宝石; 封装库来自淘宝卖家 ID：黄晶宝石: 其他店铺购入均为盗版，不享受售后技术支持服务，请立即申请退款; BOM名称: 小功率贴片电感; 联系售后: https://shop463601444.taobao.com
R?#66-R?#69 R?#71-R?#73 R?#75-R?#81 = R: as R?#60-R?#65 on sheet HDMI; BOM名称: 贴片电阻; 联系售后: https://shop463601444.taobao.com
R?#70 R?#74 = R-8P4R: 贴片排阻; BOM名称: 贴片网络排阻; 版权归属: 封装库来自淘宝 ID：黄晶宝石; 联系售后: https://shop463601444.taobao.com
U?#15 = RTL8211E-VB-CG: No Description Available; Mfr_Name: Realtek; Copyright: Copyright (C) 2023 Ultra Librarian. All rights reserved.; Manufacturer_Part_Number: RTL8211E-VB-CG; RefDes: RefDes; Type: DEV
X?#2 = XTAL-4P: 4脚无源晶振; 版权归属: 封装库来自淘宝卖家 ID：黄晶宝石; BOM名称: 4脚无源晶振; 学习资源: https://shop463601444.taobao.com

## Sheet USB_HUB.SchDoc
size A4; SheetNumber: 14; SheetTotal: 16
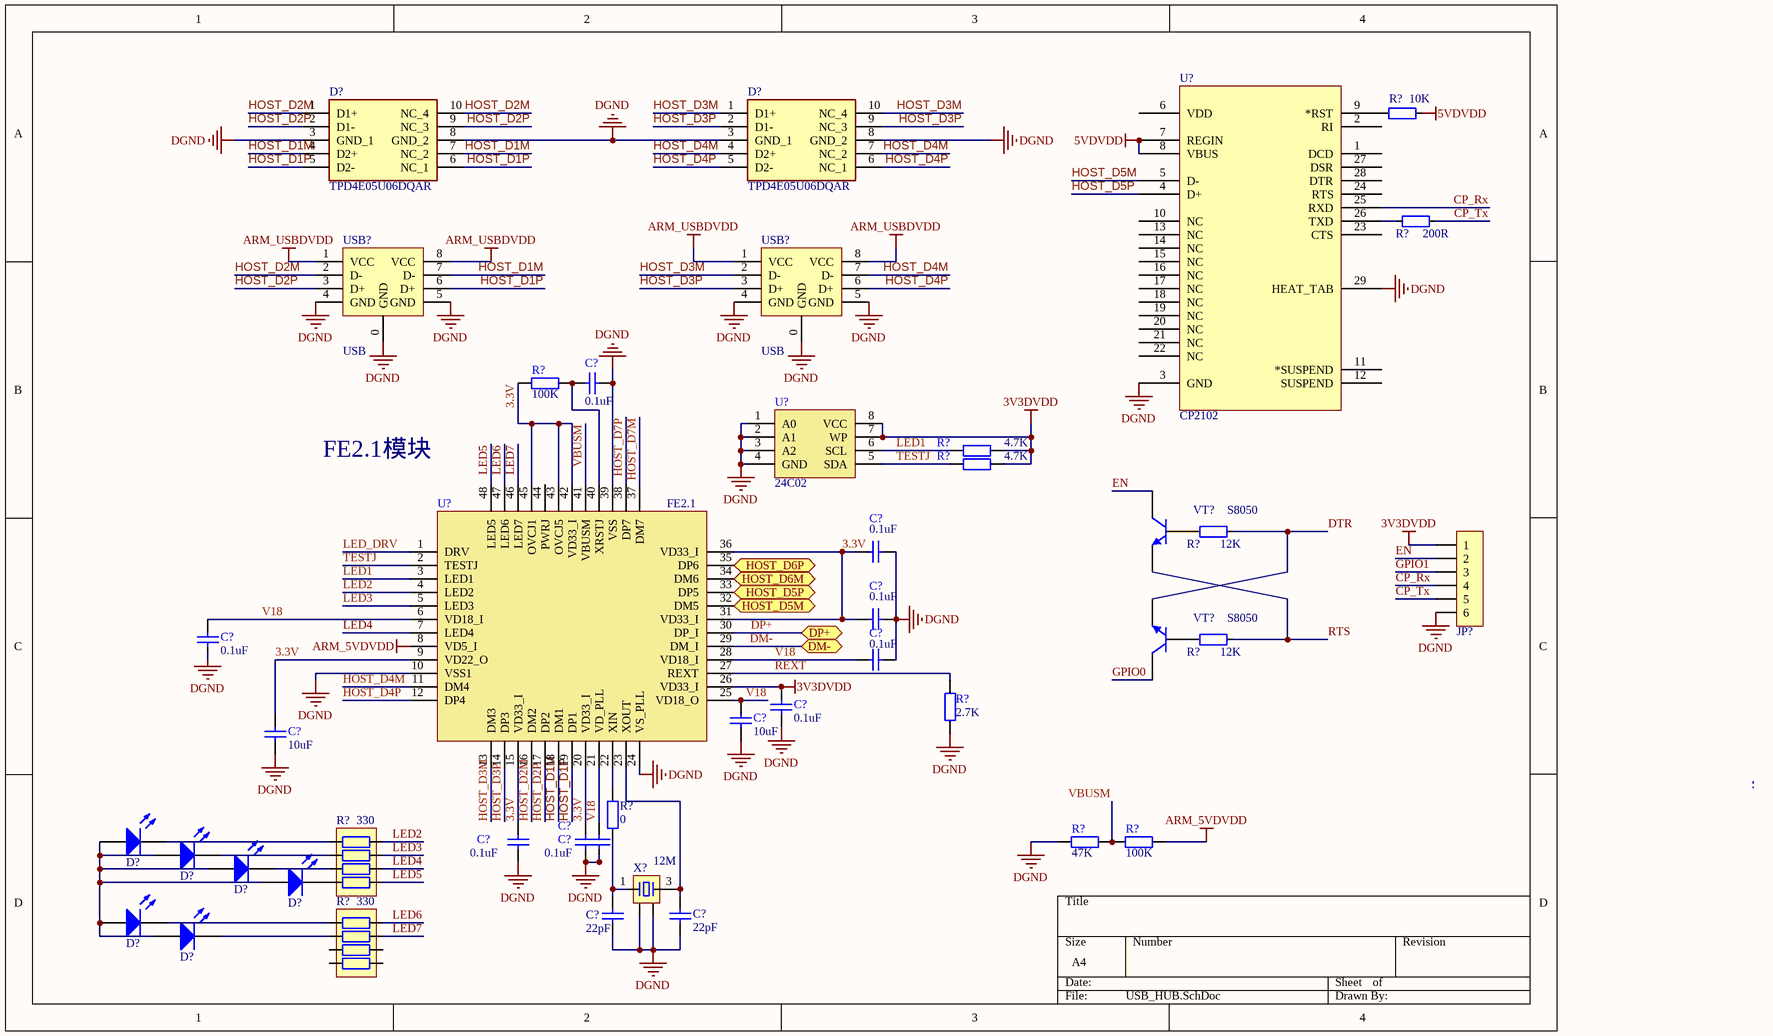
[diagram p11: USB_HUB.SchDoc]

### Parts
(Parts that share a designator on the sheet are numbered #1, #2 ... from top to bottom, then left to right.)
C?#74  0.1uF  [C 0603_L]
C?#75  0.1uF  [C 0603_L]
C?#76  0.1uF  [C 0603_L]
C?#77  0.1uF  [C 0603_L]
C?#78  0.1uF  [C 0603_L]
C?#79  0.1uF  [C 0603_L]
C?#80  10uF  [C 0603_L]
C?#81  10uF  [C 0603_L]
C?#82  0.1uF  [C 0603_L]
C?#83  0.1uF  [C 0603_L]
C?#84  0.1uF  [C 0603_L]  (value not drawn)
C?#85  22pF  [0603_C]
C?#86  22pF  [0603_C]
D?#31  TPD4E05U06DQAR  [DQA(R-PUSON-N10)]
D?#32  TPD4E05U06DQAR  [DQA(R-PUSON-N10)]
D?#33  LED  [LED_A1]  (value not drawn)
D?#34  LED  [LED_A1]  (value not drawn)
D?#35  LED  [LED_A1]  (value not drawn)
D?#36  LED  [LED_A1]  (value not drawn)
D?#37  LED  [LED_A1]  (value not drawn)
D?#38  LED  [LED_A1]  (value not drawn)
JP?#2  HDR-1X6  [XH2.54-WI-6P]  (value not drawn)
R?#82  10K  [RES_0402]
R?#83  200R  [RES_0402]
R?#84  100K  [0603]
R?#85  4.7K  [0603]
R?#86  4.7K  [0603]
R?#87  12K  [RES_0402]
R?#88  12K  [RES_0402]
R?#89  2.7K  [0603]
R?#90  47K  [0603]
R?#91  100K  [0603]
R?#92  330  [RCA-8P4R-0603]
R?#93  0  [R 0603_L]
R?#94  330  [RCA-8P4R-0603]
U?#16  CP2102  [QFN32 5x5_L]
U?#17  24C02  [SOP-8]
U?#18  FE2.1  [LQFP48 7X7_L]
USB?#4  USB  [USB A/2-17]
USB?#5  USB  [USB A/2-17]
VT?#1  S8050  [SMT_TRIODE_NPN]
VT?#2  S8050  [SMT_TRIODE_NPN]
X?#3  12M  [OSC 3225-4P]

### Ports
DM- (bidir), DP+ (bidir), HOST_D5M (bidir), HOST_D5P (bidir), HOST_D6M (bidir), HOST_D6P (bidir)

### Nets
3V3DVDD: C?#79.2 JP?#2.1 R?#85.1 R?#86.1 U?#17.7(WP) U?#17.8(VCC) U?#18.26(VD33_I)
5VDVDD: R?#82.1 U?#16.7(REGIN) U?#16.8(VBUS)
ARM_5VDVDD: R?#91.2 U?#18.8(VD5_I)
ARM_USBDVDD: USB?#4.1(VCC) USB?#4.8(VCC) USB?#5.1(VCC) USB?#5.8(VCC)
DGND: C?#74.1 C?#75.1 C?#76.1 C?#77.1 C?#78.1 C?#79.1 C?#80.1 C?#81.1 C?#82.1 C?#83.1 C?#84.1 C?#85.2 C?#86.2 D?#31.3(GND_1) D?#31.8(GND_2) D?#32.3(GND_1) D?#32.8(GND_2) JP?#2.6 R?#89.1 R?#90.1 U?#16.3(GND) U?#16.29(HEAT_TAB) U?#17.1(A0) U?#17.2(A1) U?#17.3(A2) U?#17.4(GND) U?#18.10(VSS1) U?#18.24(VS_PLL) U?#18.39(VSS) USB?#4.0(GND) USB?#4.4(GND) USB?#4.5(GND) USB?#5.0(GND) USB?#5.4(GND) USB?#5.5(GND) X?#3.2 X?#3.4
3.3V: C?#75.2 C?#76.2 C?#81.2 C?#82.2 C?#83.2 R?#84.1 U?#18.9(VD22_O) U?#18.15(VD33_I) U?#18.20(VD33_I) U?#18.31(VD33_I) U?#18.36(VD33_I) U?#18.42(VD33_I) U?#18.43(OVCJ5) U?#18.45(OVCJ1)
CP_Rx: JP?#2.4 U?#16.25(RXD)
CP_Tx: JP?#2.5 R?#83.1
DM-: U?#18.29(DM_I) ; port DM-
DP+: U?#18.30(DP_I) ; port DP+
DTR: R?#87.1 VT?#2.2(E)
EN: JP?#2.2 VT?#1.3(C)
GPIO0: VT?#2.3(C)
GPIO1: JP?#2.3
HOST_D1M: D?#31.4(D2+) D?#31.7(NC_2) U?#18.18(DM1) USB?#4.7(D-)
HOST_D1P: D?#31.5(D2-) D?#31.6(NC_1) U?#18.19(DP1) USB?#4.6(D+)
HOST_D2M: D?#31.1(D1+) D?#31.10(NC_4) U?#18.16(DM2) USB?#4.2(D-)
HOST_D2P: D?#31.2(D1-) D?#31.9(NC_3) U?#18.17(DP2) USB?#4.3(D+)
HOST_D3M: D?#32.1(D1+) D?#32.10(NC_4) U?#18.13(DM3) USB?#5.2(D-)
HOST_D3P: D?#32.2(D1-) D?#32.9(NC_3) U?#18.14(DP3) USB?#5.3(D+)
HOST_D4M: D?#32.4(D2+) D?#32.7(NC_2) U?#18.11(DM4) USB?#5.7(D-)
HOST_D4P: D?#32.5(D2-) D?#32.6(NC_1) U?#18.12(DP4) USB?#5.6(D+)
HOST_D5M: U?#16.5(D-)
HOST_D5P: U?#16.4(D+)
HOST_D7M: U?#18.37(DM7)
HOST_D7P: U?#18.38(DP7)
LED1: R?#85.2 U?#17.6(SCL) U?#18.3(LED1)
LED2: R?#92.8 U?#18.4(LED2)
LED3: R?#92.7 U?#18.5(LED3)
LED4: R?#92.6 U?#18.7(LED4)
LED5: R?#92.5 U?#18.48(LED5)
LED6: R?#94.8 U?#18.47(LED6)
LED7: R?#94.7 U?#18.46(LED7)
LED_DRV: U?#18.1(DRV)
REXT: R?#89.2 U?#18.27(REXT)
RTS: R?#88.1 VT?#1.2(E)
TESTJ: R?#86.2 U?#17.5(SDA) U?#18.2(TESTJ)
V18: C?#77.2 C?#78.2 C?#80.2 C?#84.2 U?#18.6(VD18_I) U?#18.21(VD_PLL) U?#18.25(VD18_O) U?#18.28(VD18_I)
VBUSM: R?#90.2 R?#91.1 U?#18.41(VBUSM)
NetC?#74_2: C?#74.2 R?#84.2 U?#18.40(XRSTJ)
NetC?#85_1: C?#85.1 R?#93.1 X?#3.1
NetC?#86_1: C?#86.1 U?#18.23(XOUT) X?#3.3
NetD?#33_1: D?#33.1(A) D?#34.1(A) D?#35.1(A) D?#36.1(A) D?#37.1(A) D?#38.1(A)
NetD?#33_2: D?#33.2(K) R?#92.1
NetD?#34_2: D?#34.2(K) R?#92.2
NetD?#35_2: D?#35.2(K) R?#92.3
NetD?#36_2: D?#36.2(K) R?#92.4
NetD?#37_2: D?#37.2(K) R?#94.1
NetD?#38_2: D?#38.2(K) R?#94.2
NetR?#82_2: R?#82.2 U?#16.9(*RST)
NetR?#83_2: R?#83.2 U?#16.26(TXD)
NetR?#87_2: R?#87.2 VT?#1.1(B)
NetR?#88_2: R?#88.2 VT?#2.1(B)
NetR?#93_2: R?#93.2 U?#18.22(XIN)
NetU?#18_32: U?#18.32(DM5) ; port HOST_D5M
NetU?#18_33: U?#18.33(DP5) ; port HOST_D5P
NetU?#18_34: U?#18.34(DM6) ; port HOST_D6M
NetU?#18_35: U?#18.35(DP6) ; port HOST_D6P

Not connected (* = marked no-connect by the designer): R?#94 3 4 5 6; U?#16 1(DCD) 2(RI) 6(VDD) 10(NC) 11(*SUSPEND) 12(SUSPEND) 13(NC) 14(NC) 15(NC) 16(NC) 17(NC) 18(NC) 19(NC) 20(NC) 21(NC) 22(NC) 23(CTS) 24(RTS) 27(DSR) 28(DTR); U?#18 44(PWRJ)

### Notes on the sheet
- FE2.1模块

### Library data of the parts
C?#74-C?#86 = Cap: Capacitor
  C?#74 C?#75 C?#78 C?#79 C?#83 C?#84: Published: 8-Jun-2000; LatestRevisionDate: 17-Jul-2002; LatestRevisionNote: Re-released for DXP Platform.; PackageReference: RAD-0.3; Publisher: Altium Limited
  C?#76 C?#77 C?#80-C?#82: Published: *; LatestRevisionDate: *; LatestRevisionNote: *; PackageReference: *; Publisher: *; Value: *
  C?#85 C?#86: Published: 8-Jun-2000; LatestRevisionDate: 17-Jul-2002; LatestRevisionNote: Re-released for DXP Platform.; PackageReference: RAD-0.3; Publisher: Altium Limited; Value: 22pF
D?#31 D?#32 = TPD4E05U06DQAR: as D?#26-D?#28 on sheet HDMI; Datasheet Link: http://www.ti.com/lit/gpn/tpd4e05u06; Manufacturer_Part_Number: TPD4E05U06DQAR; Mouser Part Number: 595-TPD4E05U06DQAR; Mouser Price/Stock: https://www.mouser.co.uk/ProductDetail/Texas-Instruments/TPD4E05U06DQAR?qs=%2FCrDlo5IrVPi4woOvWz0qA%3D%3D; Arrow Part Number: TPD4E05U06DQAR; Arrow Price/Stock: https://www.arrow.com/en/products/tpd4e05u06dqar/texas-instruments?region=nac
D?#33-D?#38 = LED: 发光二极管; 技术支持，联系售后: https://shop463601444.taobao.com
JP?#2 = Header 6: 6P接插件; 版权归属: 封装库来自淘宝 ID：黄晶宝石; BOM名称: 6P接插件; 学习资源: https://shop463601444.taobao.com
R?#82 R?#83 R?#87 R?#88 = 电阻-0402: Resistor; Value: 22R
R?#84-R?#86 R?#89-R?#91 = Res2: Resistor
  R?#84 R?#90 R?#91: Published: 8-Jun-2000; LatestRevisionDate: 17-Jul-2002; LatestRevisionNote: Re-released for DXP Platform.; PackageReference: AXIAL-0.4; Publisher: Altium Limited
  R?#85 R?#86 R?#89: Published: *; LatestRevisionDate: *; LatestRevisionNote: *; PackageReference: *; Publisher: *; Value: *
R?#92 R?#94 = R-8P4R: 贴片排阻; BOM名称: 贴片网络排阻
R?#93 = R: as R?#60-R?#65 on sheet HDMI; BOM名称: 贴片电阻; 联系售后: https://shop463601444.taobao.com
U?#16 = CP2102: USB转TTL; PART DESC: SINGLE-CHIP USB TO UART BRIDGE, QFN28, RoHS.; MFG #1: SILICON LABS; PART NUMBER: CP2102; Value: Value; RefDes: RefDes; Type: DEV
U?#18 = F2.1
USB?#4 USB?#5 = USB-A/2: USB-A型双层母接口; BOM名称: USB-A型双层母接口; 学习资源: https://shop463601444.taobao.com
VT?#1 VT?#2 = SMT_TRIODE_NPN: Surface mount NPN transistor, package SOT-23
X?#3 = XTAL-4P: 4脚无源晶振; 版权归属: 封装库来自淘宝卖家 ID：黄晶宝石; BOM名称: 4脚无源晶振; 学习资源: https://shop463601444.taobao.com

## Sheet STM32F103.SchDoc
size A3; SheetNumber: 7; SheetTotal: 16
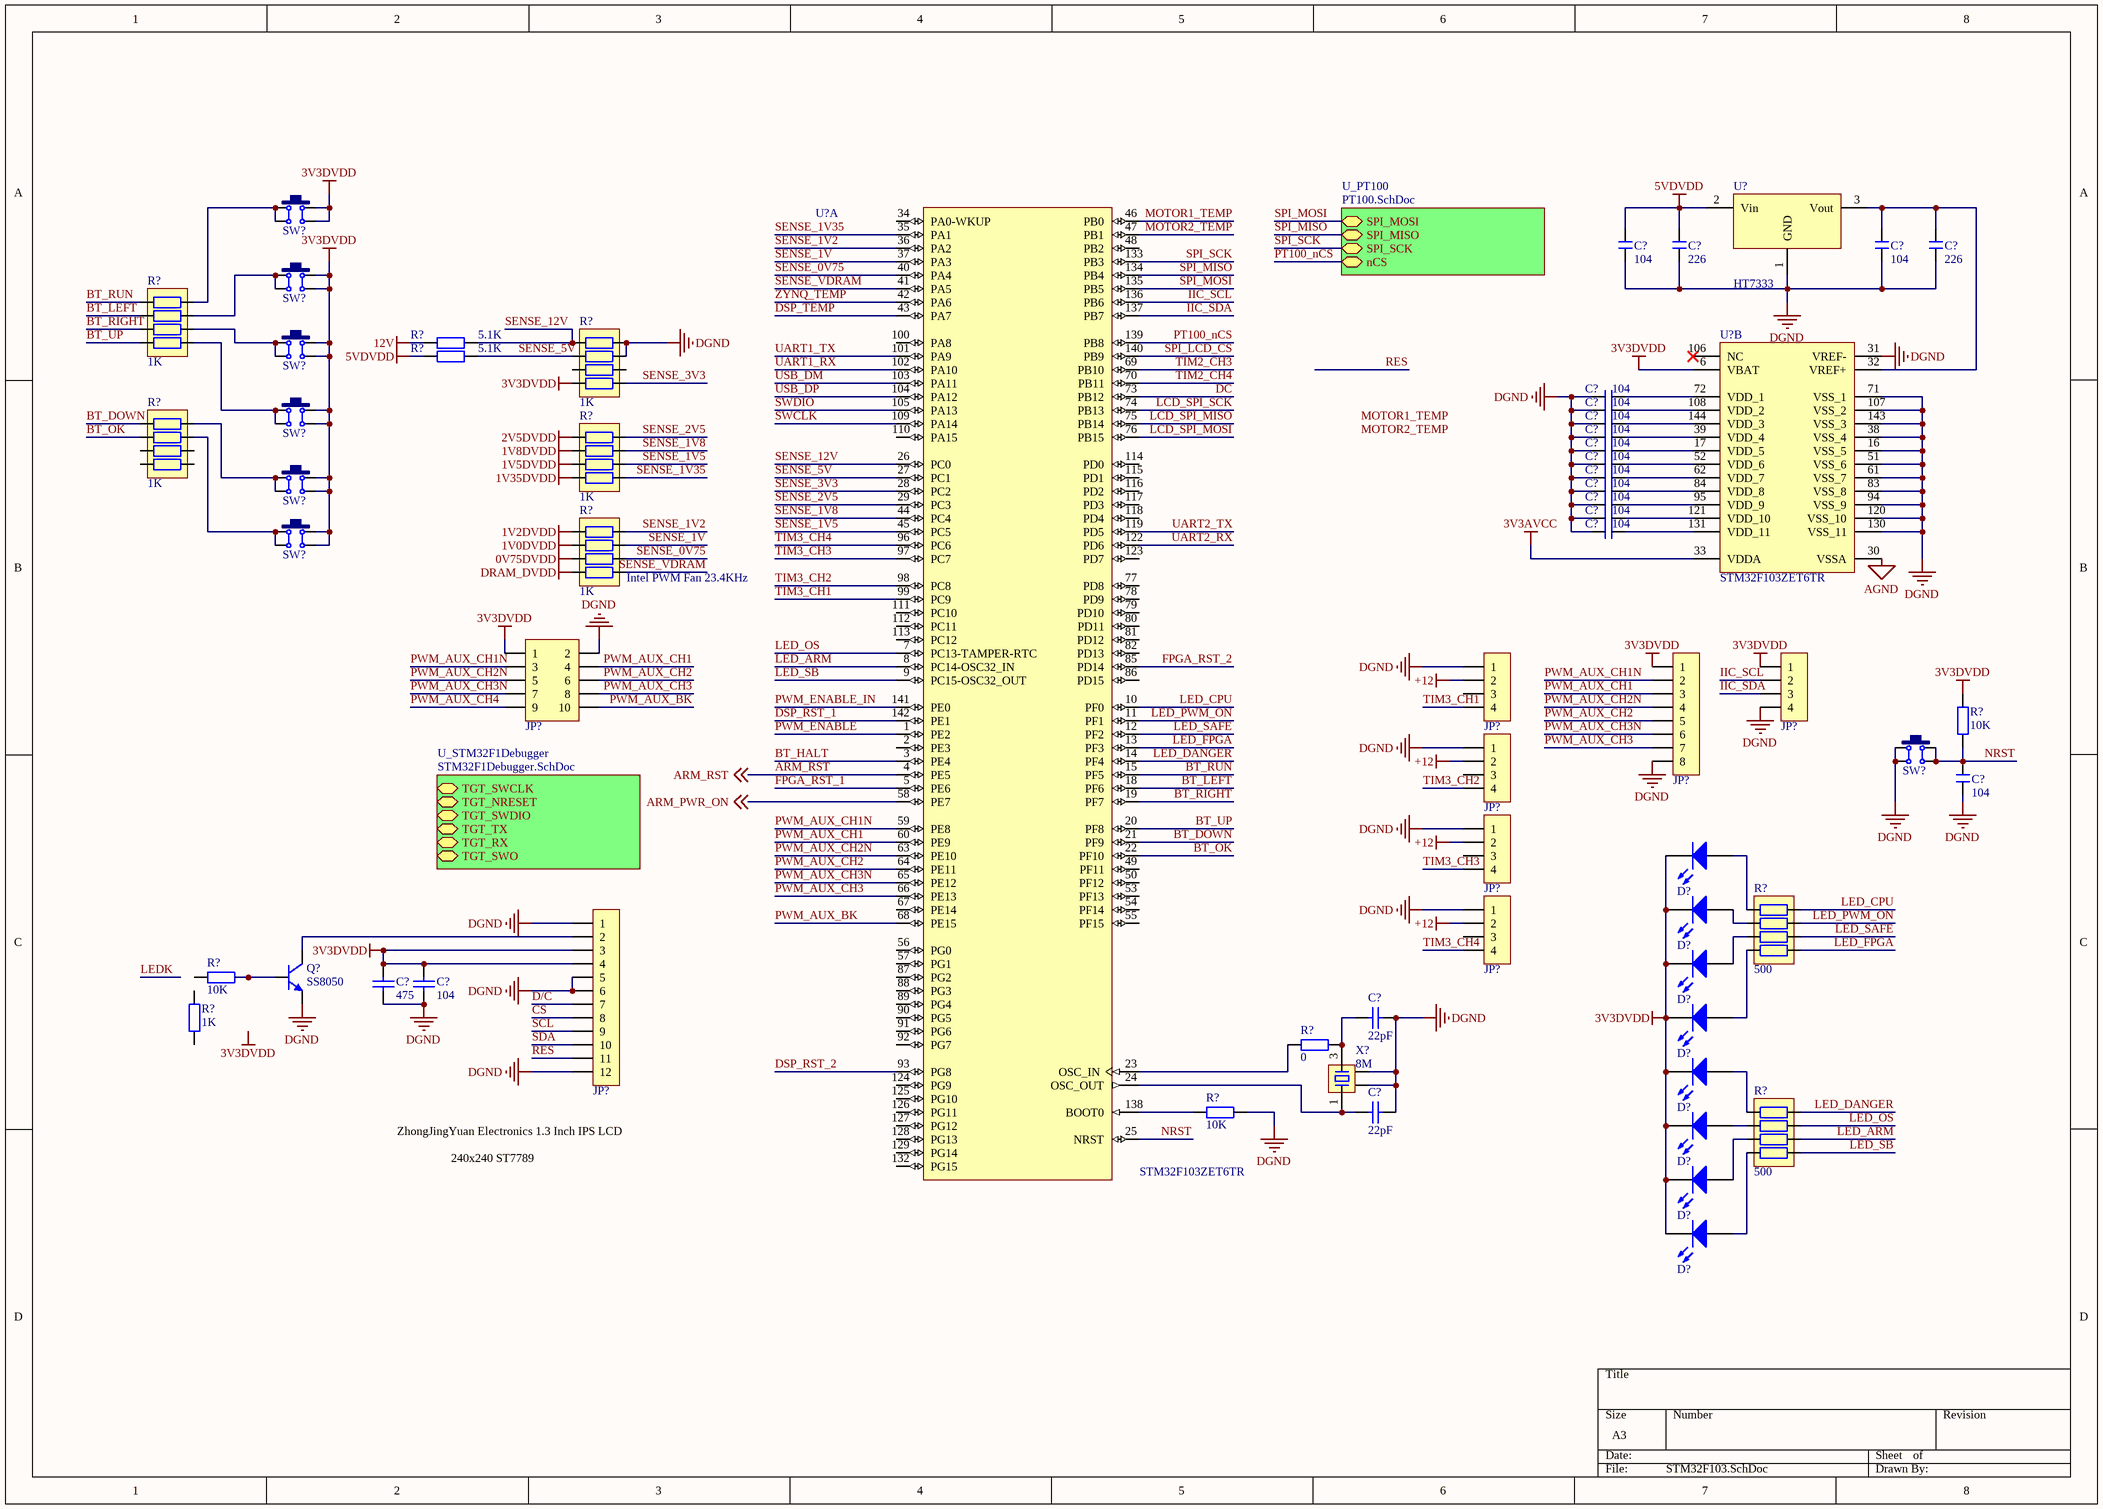
[diagram p12: STM32F103.SchDoc]

### Parts
(Parts that share a designator on the sheet are numbered #1, #2 ... from top to bottom, then left to right.)
C?#87  104  [C 0603_L]
C?#88  226  [C 0603_L]
C?#89  104  [C 0603_L]
C?#90  226  [C 0603_L]
C?#91  104  [C 0603_L]
C?#92  104  [C 0603_L]
C?#93  104  [C 0603_L]
C?#94  104  [C 0603_L]
C?#95  104  [C 0603_L]
C?#96  104  [C 0603_L]
C?#97  104  [C 0603_L]
C?#98  104  [C 0603_L]
C?#99  104  [C 0603_L]
C?#100  104  [C 0603_L]
C?#101  104  [C 0603_L]
C?#102  104  [C 0603_L]
C?#103  475  [0603_C]
C?#104  104  [0603_C]
C?#105  22pF  [0603_C]
C?#106  22pF  [0603_C]
D?#39  LED  [LED 0603W]  (value not drawn)
D?#40  LED  [LED 0603W]  (value not drawn)
D?#41  LED  [LED 0603W]  (value not drawn)
D?#42  LED  [LED 0603W]  (value not drawn)
D?#43  LED  [LED 0603W]  (value not drawn)
D?#44  LED  [LED 0603W]  (value not drawn)
D?#45  LED  [LED 0603W]  (value not drawn)
D?#46  LED  [LED 0603W]  (value not drawn)
JP?#3  Header 5X2  [IDC2.54-LI-2x5P]  (value not drawn)
JP?#4  HDR-1X4  [KF2510-LI-4P]  (value not drawn)
JP?#5  HDR-1X8  [XH2.54-WI-8P]  (value not drawn)
JP?#6  HDR-1X4  [XH2.54-WI-4P]  (value not drawn)
JP?#7  HDR-1X4  [KF2510-LI-4P]  (value not drawn)
JP?#8  HDR-1X4  [KF2510-LI-4P]  (value not drawn)
JP?#9  HDR-1X4  [KF2510-LI-4P]  (value not drawn)
JP?#10  HDR-1X12  [FPC0.5 2H-WS-12P]  (value not drawn)
Q?#18  SS8050  [SOT23-3N]
R?#95  1K  [RCA-8P4R-0603]
R?#96  5.1K  [R 0603_L]
R?#97  1K  [RCA-8P4R-0603]
R?#98  5.1K  [R 0603_L]
R?#99  1K  [RCA-8P4R-0603]
R?#100  1K  [RCA-8P4R-0603]
R?#101  1K  [RCA-8P4R-0603]
R?#102  10K  [R 0603_L]
R?#103  500  [RCA-8P4R-0603]
R?#104  10K  [R 0603_L]
R?#105  1K  [R 0603_L]
R?#106  0  [R 0603_L]
R?#107  10K  [R 0603_L]
R?#108  500  [RCA-8P4R-0603]
SW?#1  6x6x5  [TSW SMD-6*6*4.3]  (value not drawn)
SW?#2  6x6x5  [TSW SMD-6*6*4.3]  (value not drawn)
SW?#3  6x6x5  [TSW SMD-6*6*4.3]  (value not drawn)
SW?#4  6x6x5  [TSW SMD-6*6*4.3]  (value not drawn)
SW?#5  6x6x5  [TSW SMD-6*6*4.3]  (value not drawn)
SW?#6  6x6x5  [TSW SMD-6*6*4.3]  (value not drawn)
SW?#7  6x6x5  [TSW SMD-6*6*4.3]  (value not drawn)
U?#19  HT7333  [SOT89_N]
U?#20  STM32F103ZET6TR  [LQFP144_N]  (part A of 2)
U?#21  STM32F103ZET6TR  [LQFP144_N]  (part B of 2)
X?#4  8M  [OSC 3225-4P]

### Sub-sheets
U_PT100 = PT100.SchDoc: SPI_MOSI (bidir), SPI_MISO (bidir), SPI_SCK (bidir), nCS (bidir)
U_STM32F1Debugger = STM32F1Debugger.SchDoc: TGT_SWCLK (bidir), TGT_NRESET (bidir), TGT_SWDIO (bidir), TGT_TX (bidir), TGT_RX (bidir), TGT_SWO (bidir)

### Nets
0V75DVDD: R?#101.6
1V0DVDD: R?#101.7
1V2DVDD: R?#101.8
1V5DVDD: R?#100.6
1V8DVDD: R?#100.7
1V35DVDD: R?#100.5
2V5DVDD: R?#100.8
3V3AVCC: U?#21.33(VDDA)
3V3DVDD: C?#103.2 C?#104.2 D?#39.2(K) D?#40.2(K) D?#41.2(K) D?#42.2(K) D?#43.2(K) D?#44.2(K) D?#45.2(K) D?#46.2(K) JP?#3.1 JP?#5.1 JP?#6.1 JP?#10.3 JP?#10.4 R?#97.5 R?#102.2 SW?#1.2 SW?#1.3 SW?#2.2 SW?#2.3 SW?#3.2 SW?#3.3 SW?#4.2 SW?#4.3 SW?#5.2 SW?#5.3 SW?#6.2 SW?#6.3 U?#21.6(VBAT)
5VDVDD: C?#87.2 C?#88.2 R?#98.1 U?#19.2(Vin)
12V: R?#96.1
+12: JP?#4.2 JP?#7.2 JP?#8.2 JP?#9.2
AGND: U?#21.30(VSSA)
DGND: C?#87.1 C?#88.1 C?#89.1 C?#90.1 C?#91.1 C?#92.1 C?#93.1 C?#94.1 C?#95.1 C?#96.1 C?#97.1 C?#98.1 C?#99.1 C?#100.1 C?#101.1 C?#102.1 C?#103.1 C?#104.1 C?#105.2 C?#106.2 JP?#3.2 JP?#4.1 JP?#5.8 JP?#6.4 JP?#7.1 JP?#8.1 JP?#9.1 JP?#10.1 JP?#10.5 JP?#10.6 JP?#10.12 Q?#18.2(E) R?#97.1 R?#97.2 R?#107.2 SW?#7.1 SW?#7.4 U?#19.1(GND) U?#21.16(VSS_5) U?#21.31(VREF-) U?#21.38(VSS_4) U?#21.51(VSS_6) U?#21.61(VSS_7) U?#21.71(VSS_1) U?#21.83(VSS_8) U?#21.94(VSS_9) U?#21.107(VSS_2) U?#21.120(VSS_10) U?#21.130(VSS_11) U?#21.143(VSS_3) X?#4.2 X?#4.4
DRAM_DVDD: R?#101.5
ARM_PWR_ON: U?#20.58(PE7) ; off-sheet ARM_PWR_ON
ARM_RST: U?#20.4(PE5) ; off-sheet ARM_RST
BT_DOWN: R?#99.8 U?#20.21(PF9)
BT_HALT: U?#20.3(PE4)
BT_LEFT: R?#95.7 U?#20.18(PF6)
BT_OK: R?#99.7 U?#20.22(PF10)
BT_RIGHT: R?#95.6 U?#20.19(PF7)
BT_RUN: R?#95.8 U?#20.15(PF5)
BT_UP: R?#95.5 U?#20.20(PF8)
CS: JP?#10.8
D/C: JP?#10.7
DC: U?#20.73(PB12)
DSP_RST_1: U?#20.142(PE1)
DSP_RST_2: U?#20.93(PG8)
DSP_TEMP: U?#20.43(PA7)
FPGA_RST_1: U?#20.5(PE6)
FPGA_RST_2: U?#20.85(PD14)
IIC_SCL: JP?#6.2 U?#20.136(PB6)
IIC_SDA: JP?#6.3 U?#20.137(PB7)
LCD_SPI_MISO: U?#20.75(PB14)
LCD_SPI_MOSI: U?#20.76(PB15)
LCD_SPI_SCK: U?#20.74(PB13)
LED_ARM: R?#108.3 U?#20.8(PC14-OSC32_IN)
LED_CPU: R?#103.1 U?#20.10(PF0)
LED_DANGER: R?#108.1 U?#20.14(PF4)
LED_FPGA: R?#103.4 U?#20.13(PF3)
LED_OS: R?#108.2 U?#20.7(PC13-TAMPER-RTC)
LED_PWM_ON: R?#103.2 U?#20.11(PF1)
LED_SAFE: R?#103.3 U?#20.12(PF2)
LED_SB: R?#108.4 U?#20.9(PC15-OSC32_OUT)
MOTOR1_TEMP: U?#20.46(PB0)
MOTOR2_TEMP: U?#20.47(PB1)
NRST: C?#102.2 R?#102.1 SW?#7.2 SW?#7.3 U?#20.25(NRST)
PT100_nCS: U?#20.139(PB8) ; sheet U_PT100/nCS
PWM_AUX_BK: JP?#3.10 U?#20.68(PE15)
PWM_AUX_CH1: JP?#3.4 JP?#5.3 U?#20.60(PE9)
PWM_AUX_CH1N: JP?#3.3 JP?#5.2 U?#20.59(PE8)
PWM_AUX_CH2: JP?#3.6 JP?#5.5 U?#20.64(PE11)
PWM_AUX_CH2N: JP?#3.5 JP?#5.4 U?#20.63(PE10)
PWM_AUX_CH3: JP?#3.8 JP?#5.7 U?#20.66(PE13)
PWM_AUX_CH3N: JP?#3.7 JP?#5.6 U?#20.65(PE12)
PWM_AUX_CH4: JP?#3.9
PWM_ENABLE: U?#20.1(PE2)
PWM_ENABLE_IN: U?#20.141(PE0)
RES: JP?#10.11
SCL: JP?#10.9
SDA: JP?#10.10
SENSE_0V75: R?#101.3 U?#20.40(PA4)
SENSE_1V: R?#101.2 U?#20.37(PA3)
SENSE_1V2: R?#101.1 U?#20.36(PA2)
SENSE_1V5: R?#100.3 U?#20.45(PC5)
SENSE_1V8: R?#100.2 U?#20.44(PC4)
SENSE_1V35: R?#100.4 U?#20.35(PA1)
SENSE_2V5: R?#100.1 U?#20.29(PC3)
SENSE_3V3: R?#97.4 U?#20.28(PC2)
SENSE_5V: R?#97.7 R?#98.2 U?#20.27(PC1)
SENSE_12V: R?#96.2 R?#97.8 U?#20.26(PC0)
SENSE_VDRAM: R?#101.4 U?#20.41(PA5)
SPI_LCD_CS: U?#20.140(PB9)
SPI_MISO: U?#20.134(PB4) ; sheet U_PT100/SPI_MISO
SPI_MOSI: U?#20.135(PB5) ; sheet U_PT100/SPI_MOSI
SPI_SCK: U?#20.133(PB3) ; sheet U_PT100/SPI_SCK
SWCLK: U?#20.109(PA14)
SWDIO: U?#20.105(PA13)
TIM2_CH3: U?#20.69(PB10)
TIM2_CH4: U?#20.70(PB11)
TIM3_CH1: JP?#4.4 U?#20.99(PC9)
TIM3_CH2: JP?#7.4 U?#20.98(PC8)
TIM3_CH3: JP?#8.4 U?#20.97(PC7)
TIM3_CH4: JP?#9.4 U?#20.96(PC6)
UART1_RX: U?#20.102(PA10)
UART1_TX: U?#20.101(PA9)
UART2_RX: U?#20.122(PD6)
UART2_TX: U?#20.119(PD5)
USB_DM: U?#20.103(PA11)
USB_DP: U?#20.104(PA12)
ZYNQ_TEMP: U?#20.42(PA6)
NetC?#89_2: C?#89.2 C?#90.2 U?#19.3(Vout) U?#21.32(VREF+)
NetC?#91_2: C?#91.2 U?#21.72(VDD_1)
NetC?#92_2: C?#92.2 U?#21.108(VDD_2)
NetC?#93_2: C?#93.2 U?#21.144(VDD_3)
NetC?#94_2: C?#94.2 U?#21.39(VDD_4)
NetC?#95_2: C?#95.2 U?#21.17(VDD_5)
NetC?#96_2: C?#96.2 U?#21.52(VDD_6)
NetC?#97_2: C?#97.2 U?#21.62(VDD_7)
NetC?#98_2: C?#98.2 U?#21.84(VDD_8)
NetC?#99_2: C?#99.2 U?#21.95(VDD_9)
NetC?#100_2: C?#100.2 U?#21.121(VDD_10)
NetC?#101_2: C?#101.2 U?#21.131(VDD_11)
NetC?#105_1: C?#105.1 R?#106.1 X?#4.3
NetC?#106_1: C?#106.1 U?#20.24(OSC_OUT) X?#4.1
NetD?#39_1: D?#39.1(A) R?#103.8
NetD?#40_1: D?#40.1(A) R?#103.7
NetD?#41_1: D?#41.1(A) R?#103.6
NetD?#42_1: D?#42.1(A) R?#103.5
NetD?#43_1: D?#43.1(A) R?#108.8
NetD?#44_1: D?#44.1(A) R?#108.7
NetD?#45_1: D?#45.1(A) R?#108.6
NetD?#46_1: D?#46.1(A) R?#108.5
NetJP?#10_2: JP?#10.2 Q?#18.3(C)
NetQ?#18_1: Q?#18.1(B) R?#104.1
NetR?#95_1: R?#95.1 SW?#1.1 SW?#1.4
NetR?#95_2: R?#95.2 SW?#2.1 SW?#2.4
NetR?#95_3: R?#95.3 SW?#3.1 SW?#3.4
NetR?#95_4: R?#95.4 SW?#4.1 SW?#4.4
NetR?#99_1: R?#99.1 SW?#5.1 SW?#5.4
NetR?#99_2: R?#99.2 SW?#6.1 SW?#6.4
NetR?#106_2: R?#106.2 U?#20.23(OSC_IN)
NetR?#107_1: R?#107.1 U?#20.138(BOOT0)

Not connected (* = marked no-connect by the designer): JP?#4 3; JP?#7 3; JP?#8 3; JP?#9 3; R?#97 3 6; R?#99 3 4 5 6; R?#104 2; R?#105 1 2; U?#20 2(PE3) 34(PA0-WKUP) 48(PB2) 49(PF11) 50(PF12) 53(PF13) 54(PF14) 55(PF15) 56(PG0) 57(PG1) 67(PE14) 77(PD8) 78(PD9) 79(PD10) 80(PD11) 81(PD12) 82(PD13) 86(PD15) 87(PG2) 88(PG3) 89(PG4) 90(PG5) 91(PG6) 92(PG7) 100(PA8) 110(PA15) 111(PC10) 112(PC11) 113(PC12) 114(PD0) 115(PD1) 116(PD2) 117(PD3) 118(PD4) 123(PD7) 124(PG9) 125(PG10) 126(PG11) 127(PG12) 128(PG13) 129(PG14) 132(PG15); U?#21 106(NC)*

### Notes on the sheet
- (near R?#101) Intel PWM Fan 23.4KHz
- (near JP?#10) ZhongJingYuan Electronics 1.3 Inch IPS LCD
- 240x240 ST7789
- Labels drawn without touching a wire or pin: 3V3DVDD, MOTOR1_TEMP, MOTOR2_TEMP

### Library data of the parts
C?#87-C?#102 = C: as C?#55 on sheet HDMI; 联系售后，技术支持: https://shop463601444.taobao.com; 唯一出售店铺网址: https://shop463601444.taobao.com
C?#103-C?#106 = Cap: Capacitor; Published: 8-Jun-2000; LatestRevisionDate: 17-Jul-2002; LatestRevisionNote: Re-released for DXP Platform.; PackageReference: RAD-0.3; Publisher: Altium Limited
  C?#103: Value: 475
  C?#104: Value: 104
  C?#105 C?#106: Value: 22pF
D?#39-D?#46 = LED: 发光二极管; 技术支持，联系售后: https://shop463601444.taobao.com
JP?#3 = Header 5X2: 5*2P接插件; 版权归属: 封装库来自淘宝 ID：黄晶宝石; BOM名称: 5*2P接插件; 学习资源: https://shop463601444.taobao.com
JP?#4 JP?#6-JP?#9 = Header 4: 4P接插件; 版权归属: 封装库来自淘宝 ID：黄晶宝石; BOM名称: 4P接插件; 学习资源: https://shop463601444.taobao.com
JP?#5 = Header 8: 8P接插件; 版权归属: 封装库来自淘宝 ID：黄晶宝石; BOM名称: 8P接插件; 学习资源: https://shop463601444.taobao.com
JP?#10 = Header 12: 12P接插件; 版权归属: 封装库来自淘宝卖家 ID：黄晶宝石; BOM名称: 12P接插件; 学习资源: https://shop463601444.taobao.com
Q?#18 = 8050-SMD: 高频放大-NPN型; 版权归属: 封装库来自淘宝 ID：黄晶宝石; 属性: 40V 1.5A 1W 100MHZ; BOM名称: 高频放大-NPN型; 联系售后: https://shop463601444.taobao.com
R?#95 R?#97 R?#99-R?#101 R?#103 R?#108 = R-8P4R: as R?#70 on sheet EthernetRTL8211; 联系售后: https://shop463601444.taobao.com
R?#96 R?#98 R?#102 R?#104-R?#107 = R: as R?#60-R?#65 on sheet HDMI; BOM名称: 贴片电阻; 联系售后: https://shop463601444.taobao.com
SW?#1-SW?#7 = TSW SMD-6x6: 贴片6x6轻触开关; 版权归属: 封装库来自淘宝 ID：黄晶宝石; BOM名称: 贴片6x6轻触开关; 唯一出售店铺网址: https://shop463601444.taobao.com
U?#19 = HT7333: LDO线性稳压芯片
U?#20 U?#21 = STM32F103ZET6TR: STM32 ARM-based 32-bit MCU Performance Line with 512 kB Flash, 64 kB Internal RAM, -40 to +85癈 Temperature, 144-Pin LQFP, Tape and Reel; DatasheetVersion: rev8.0, Apr-2011; PackageVersion: 2011; PackageReference: LQFP144; PackageDescription: 144-Pin Thin Quad Flat Pack 0.5 mm Pitch; ComponentLink1Description: Manufacturer URL; ComponentLink1URL: http://www.st.com/; ComponentLink2Description: STM32F103 Datasheet; ComponentLink2URL: http://www.st.com/internet/com/TECHNICAL_RESOURCES/TECHNICAL_LITERATURE/DATASHEET/CD00191185.pdf; ComponentLink3Description: STM32 Family Web Page; ComponentLink3URL: www.st.com/stm32
X?#4 = XTAL-4P: 4脚无源晶振; 版权归属: 封装库来自淘宝卖家 ID：黄晶宝石; BOM名称: 4脚无源晶振; 学习资源: https://shop463601444.taobao.com

## Sheet STM32F1Debugger.SchDoc
size A4; SheetNumber: 1; SheetTotal: 16
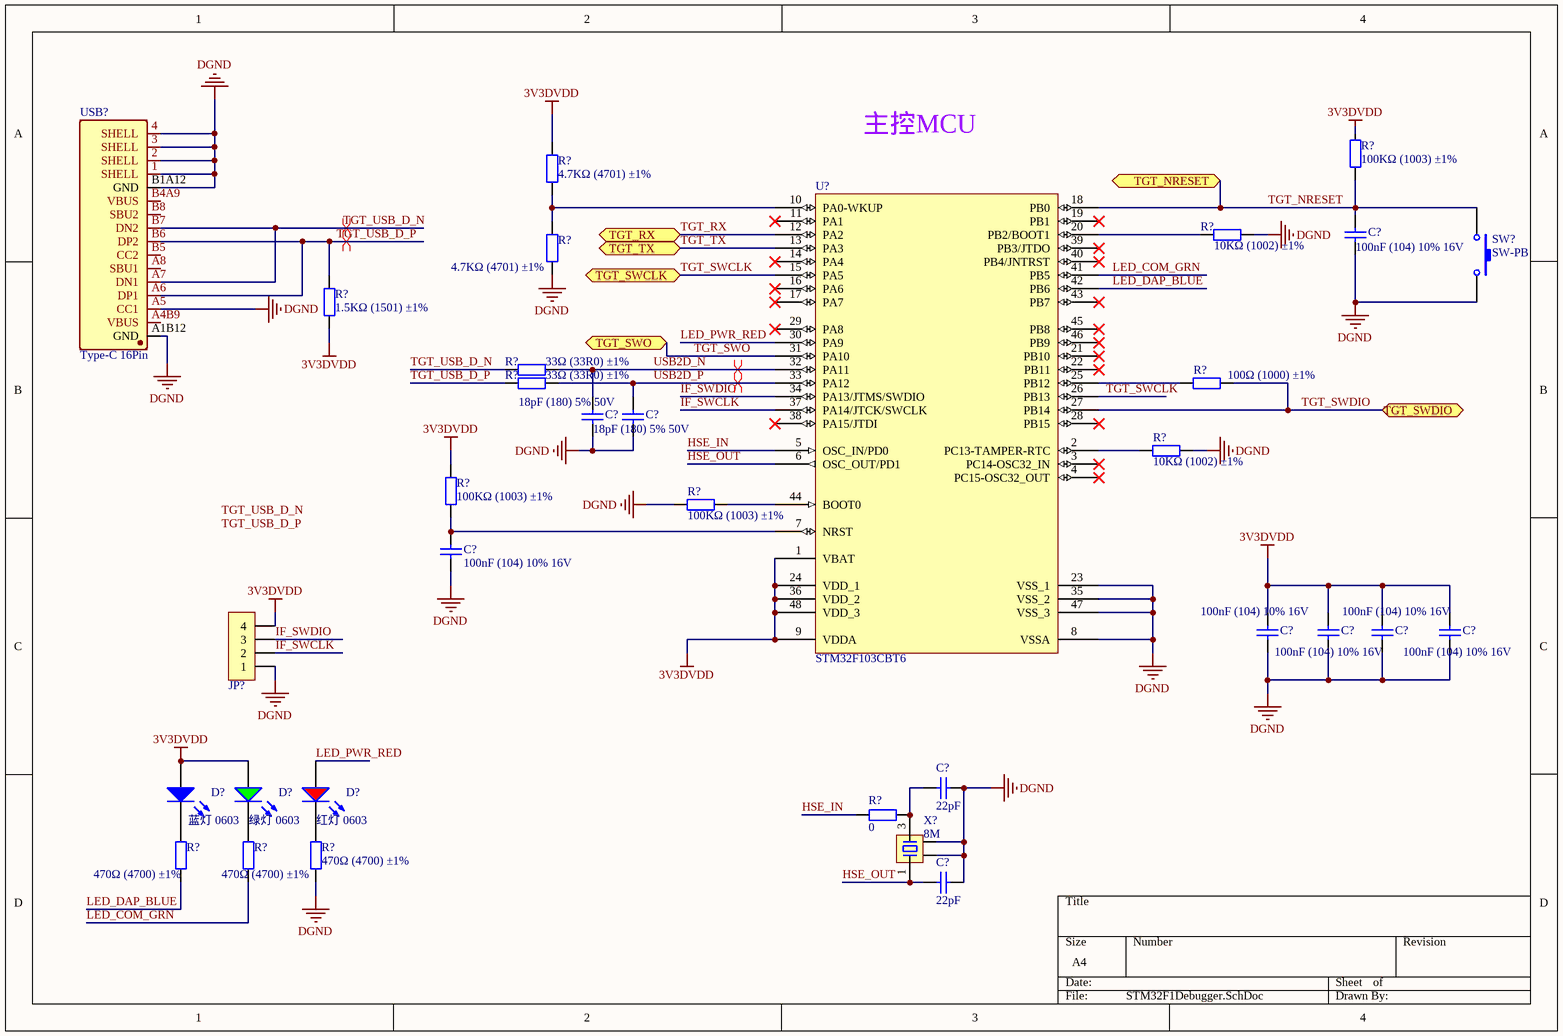
[diagram p13: STM32F1Debugger.SchDoc]

### Parts
(Parts that share a designator on the sheet are numbered #1, #2 ... from top to bottom, then left to right.)
C?#107  100nF (104) 10% 16V  [0402_C]
C?#108  18pF (180) 5% 50V  [0402_C]
C?#109  18pF (180) 5% 50V  [0402_C]
C?#110  100nF (104) 10% 16V  [0402_C]
C?#111  100nF (104) 10% 16V  [0402_C]
C?#112  100nF (104) 10% 16V  [0402_C]
C?#113  100nF (104) 10% 16V  [0402_C]
C?#114  100nF (104) 10% 16V  [0402_C]
C?#115  22pF  [0603_C]
C?#116  22pF  [0603_C]
D?#47  蓝灯 0603  [0603_LED_S1]
D?#48  绿灯 0603  [0603_LED_S1]
D?#49  红灯 0603  [0603_LED_S1]
JP?#11  HDR-1X4  [XH2.54-WI-4P]  (value not drawn)
R?#109  100KΩ (1003) ±1%  [0402_R]
R?#110  4.7KΩ (4701) ±1%  [0402_R]
R?#111  10KΩ (1002) ±1%  [0402_R]
R?#112  4.7KΩ (4701) ±1%  [0402_R]
R?#113  1.5KΩ (1501) ±1%  [0402_R]
R?#114  33Ω (33R0) ±1%  [0402_R]
R?#115  33Ω (33R0) ±1%  [0402_R]
R?#116  100Ω (1000) ±1%  [0402_R]
R?#117  10KΩ (1002) ±1%  [0402_R]
R?#118  100KΩ (1003) ±1%  [0402_R]
R?#119  100KΩ (1003) ±1%  [0402_R]
R?#120  0  [R 0603_L]
R?#121  470Ω (4700) ±1%  [0402_R]
R?#122  470Ω (4700) ±1%  [0402_R]
R?#123  470Ω (4700) ±1%  [0402_R]
SW?#8  SW-PB  [PB_TYCO_FSMSM]
U?#22  STM32F103CBT6  [STM32F103CBT6-Footprint-1]
USB?#6  Type-C 16Pin  [typec 16p]
X?#5  8M  [OSC 3225-4P]

### Ports
TGT_NRESET (bidir), TGT_RX (bidir), TGT_SWCLK (bidir), TGT_SWDIO (bidir), TGT_SWO (bidir), TGT_TX (bidir)

### Nets
3V3DVDD: C?#111.2 C?#112.2 C?#113.2 C?#114.2 D?#47.A D?#48.A JP?#11.4 R?#109.2 R?#110.2 R?#113.1 R?#118.2 U?#22.1(VBAT) U?#22.9(VDDA) U?#22.24(VDD_1) U?#22.36(VDD_2) U?#22.48(VDD_3)
DGND: C?#107.1 C?#108.1 C?#109.1 C?#110.1 C?#111.1 C?#112.1 C?#113.1 C?#114.1 C?#115.2 C?#116.2 JP?#11.1 R?#111.2 R?#112.1 R?#117.2 R?#119.2 R?#123.1 SW?#8.2 U?#22.8(VSSA) U?#22.23(VSS_1) U?#22.35(VSS_2) U?#22.47(VSS_3) USB?#6.1(SHELL) USB?#6.2(SHELL) USB?#6.3(SHELL) USB?#6.4(SHELL) USB?#6.A1B12(GND) USB?#6.A5(CC1) USB?#6.B1A12(GND) X?#5.2 X?#5.4
HSE_IN: R?#120.2 U?#22.5(OSC_IN/PD0)
HSE_OUT: C?#116.1 U?#22.6(OSC_OUT/PD1) X?#5.1
IF_SWCLK: JP?#11.2 U?#22.37(PA14/JTCK/SWCLK)
IF_SWDIO: JP?#11.3 U?#22.34(PA13/JTMS/SWDIO)
LED_COM_GRN: R?#122.1 U?#22.41(PB5)
LED_DAP_BLUE: R?#121.1 U?#22.42(PB6)
LED_PWR_RED: D?#49.A U?#22.30(PA9)
TGT_NRESET: C?#107.2 R?#109.1 SW?#8.1 U?#22.18(PB0) ; port TGT_NRESET
TGT_RX: U?#22.12(PA2) ; port TGT_RX
TGT_SWCLK: U?#22.15(PA5) U?#22.26(PB13) ; port TGT_SWCLK
TGT_SWDIO: R?#116.2 U?#22.27(PB14) ; port TGT_SWDIO
TGT_SWO: U?#22.31(PA10) ; port TGT_SWO
TGT_TX: U?#22.13(PA3) ; port TGT_TX
TGT_USB_D_N: R?#114.1 USB?#6.A7(DN1) USB?#6.B7(DN2)
TGT_USB_D_P: R?#113.2 R?#115.1 USB?#6.A6(DP1) USB?#6.B6(DP2)
USB2D_N: C?#108.2 R?#114.2 U?#22.32(PA11)
USB2D_P: C?#109.2 R?#115.2 U?#22.33(PA12)
NetC?#110_2: C?#110.2 R?#118.1 U?#22.7(NRST)
NetC?#115_1: C?#115.1 R?#120.1 X?#5.3
NetD?#47_K: D?#47.K R?#121.2
NetD?#48_K: D?#48.K R?#122.2
NetD?#49_K: D?#49.K R?#123.2
NetR?#110_1: R?#110.1 R?#112.2 U?#22.10(PA0-WKUP)
NetR?#111_1: R?#111.1 U?#22.20(PB2/BOOT1)
NetR?#116_1: R?#116.1 U?#22.25(PB12)
NetR?#117_1: R?#117.1 U?#22.2(PC13-TAMPER-RTC)
NetR?#119_1: R?#119.1 U?#22.44(BOOT0)

Not connected (* = marked no-connect by the designer): U?#22 3(PC14-OSC32_IN)* 4(PC15-OSC32_OUT)* 11(PA1)* 14(PA4)* 16(PA6)* 17(PA7)* 19(PB1)* 21(PB10)* 22(PB11)* 28(PB15)* 29(PA8)* 38(PA15/JTDI)* 39(PB3/JTDO)* 40(PB4/JNTRST)* 43(PB7)* 45(PB8)* 46(PB9)*; USB?#6 A4B9(VBUS) A8(SBU1) B4A9(VBUS) B5(CC2) B8(SBU2)

### Layout directives
differential pair; differential pair class USB2Diff: TGT_USB_D_N, TGT_USB_D_P, USB2D_N, USB2D_P

### Notes on the sheet
- 主控MCU
- Labels drawn without touching a wire or pin: TGT_USB_D_N, TGT_USB_D_P

### Library data of the parts
C?#107 C?#110-C?#114 = 0402 100nF (104) 10% 16V: 贴片电容; ComponentLink1Description: 供应商链接; ComponentLink1URL: http://www.szlcsc.com/product/details_1877.html; Package: 0402; Supplier: LC; SuppliersPartNumber: C1525
C?#108 C?#109 = 0402 18pF (180) 5% 50V: 贴片电容; ComponentLink1Description: 供应商链接; ComponentLink1URL: http://www.szlcsc.com/product/details_1901.html; Package: 0402; Supplier: LC; SuppliersPartNumber: C1549
C?#115 C?#116 = Cap: Capacitor; Published: 8-Jun-2000; LatestRevisionDate: 17-Jul-2002; LatestRevisionNote: Re-released for DXP Platform.; PackageReference: RAD-0.3; Publisher: Altium Limited; Value: 22pF
D?#47 = 0603 蓝灯: 发光二极管; ComponentLink1Description: 供应商链接; ComponentLink1URL: http://www.szlcsc.com/product/details_73150.html; Package: 0603; Supplier: LC; SuppliersPartNumber: C72041
D?#48 = 0603 绿灯: 发光二极管; ComponentLink1Description: 供应商链接; ComponentLink1URL: http://www.szlcsc.com/product/details_73152.html; Package: 0603; Supplier: LC; SuppliersPartNumber: C72043
D?#49 = 0603 红灯: 发光二极管; ComponentLink1Description: 供应商链接; ComponentLink1URL: http://www.szlcsc.com/product/details_2659.html; Package: 0603; Supplier: LC; SuppliersPartNumber: C2286
JP?#11 = Header 4: 4P接插件; 版权归属: 封装库来自淘宝 ID：黄晶宝石; BOM名称: 4P接插件; 学习资源: https://shop463601444.taobao.com
R?#109 R?#118 R?#119 = 0402 100KΩ (1003) 1%: 贴片电阻; ComponentLink1Description: 供应商链接; ComponentLink1URL: http://www.szlcsc.com/product/details_26484.html; Package: 0402; Supplier: LC; SuppliersPartNumber: C25741
R?#110 R?#112 = 0402 4.7KΩ (4701) 1%: 贴片电阻; ComponentLink1Description: 供应商链接; ComponentLink1URL: http://www.szlcsc.com/product/details_26643.html; Package: 0402; Supplier: LC; SuppliersPartNumber: C25900
R?#111 R?#117 = 0402 10KΩ (1002) 1%: 贴片电阻; ComponentLink1Description: 供应商链接; ComponentLink1URL: http://www.szlcsc.com/product/details_26487.html; Package: 0402; Supplier: LC; SuppliersPartNumber: C25744
R?#113 = 0402 1.5KΩ (1501) 1%: 贴片电阻; ComponentLink1Description: 供应商链接; ComponentLink1URL: http://www.szlcsc.com/product/details_26610.html; Package: 0402; Supplier: LC; SuppliersPartNumber: C25867
R?#114 R?#115 = 0402 33Ω (33R0) 1%: 贴片电阻; ComponentLink1Description: 供应商链接; ComponentLink1URL: http://www.szlcsc.com/product/details_25848.html; Package: 0402; Supplier: LC; SuppliersPartNumber: C25105
R?#116 = 0402 100Ω (1000) 1%: 贴片电阻; ComponentLink1Description: 供应商链接; ComponentLink1URL: http://www.szlcsc.com/product/details_25819.html; Package: 0402; Supplier: LC; SuppliersPartNumber: C25076
R?#120 = R: as R?#60-R?#65 on sheet HDMI; BOM名称: 贴片电阻; 联系售后: https://shop463601444.taobao.com
R?#121-R?#123 = 0402 470Ω (4700) 1%: 贴片电阻; ComponentLink1Description: 供应商链接; ComponentLink1URL: http://www.szlcsc.com/product/details_25860.html; Package: 0402; Supplier: LC; SuppliersPartNumber: C25117
SW?#8 = SW-PB: Switch; Published: 24-Mar-1999; LatestRevisionDate: 17-Jul-2002; LatestRevisionNote: Re-released for DXP Platform.; PackageReference: SPST-2; Publisher: Altium Limited; PackageDescription: Switch; 2 Leads
U?#22 = CMP-020-00023-1: ARM® 32-bit Cortex®-M3 CPU Core,72 MHz maximum frequency; RAM Size: 64 or 128 Kbytes of Flash memory, 20 Kbytes of SRAM; Pins: 48; Case/Package: LQFP48
USB?#6 = TYPE-C16PIN: ComponentLink1Description: 嘉立创; ComponentLink1URL: https://item.szlcsc.com/372551.html; Datasheet: javascript:fileModule.downloadFileNoRemark('https://atta.szlcsc.com/upload/public/pdf/source/20190521/C393939_7B9043D4CF1026AF443AB60D91FBCD5C.pdf%3FExpires%3D4070880000%26OSSAccessKeyId%3DLTAIJDIkh7KmGS1H%26Signature%3DcQcE%252FNX1dDNXtBUBosJ1RmuR16Q%253D%26response-content-disposition%3Dattachment%253Bfilename%253DC393939_TYPE-C%2525E6%2525AF%25258D%2525E5%2525BA%2525A716PIN%2525E5%2525BF%2525AB%2525E5%252585%252585%2525E9%252597%2525AA%2525E5%252585%252585USB3.0%2525E6%2525B2%252589%2525E6%25259D%2525BF%2525E6%2525AF%25258D%2525E5%2525BA%2525A7%2525E8%2525BF%25259E%2525E6%25258E%2525A5%2525E5%252599%2525A8_2019-05-21.PDF','60D38A6780882313296C67311B688FC3','new_pdf_doc_pdf','');buriedPoint({ty: 'click',op: 'download_pdf',data: 'C393939'});
X?#5 = XTAL-4P: 4脚无源晶振; 版权归属: 封装库来自淘宝卖家 ID：黄晶宝石; BOM名称: 4脚无源晶振; 学习资源: https://shop463601444.taobao.com